# EAGLE design PT_2016_PB_4lyr_Rev2 (EAGLE 6.5.0)
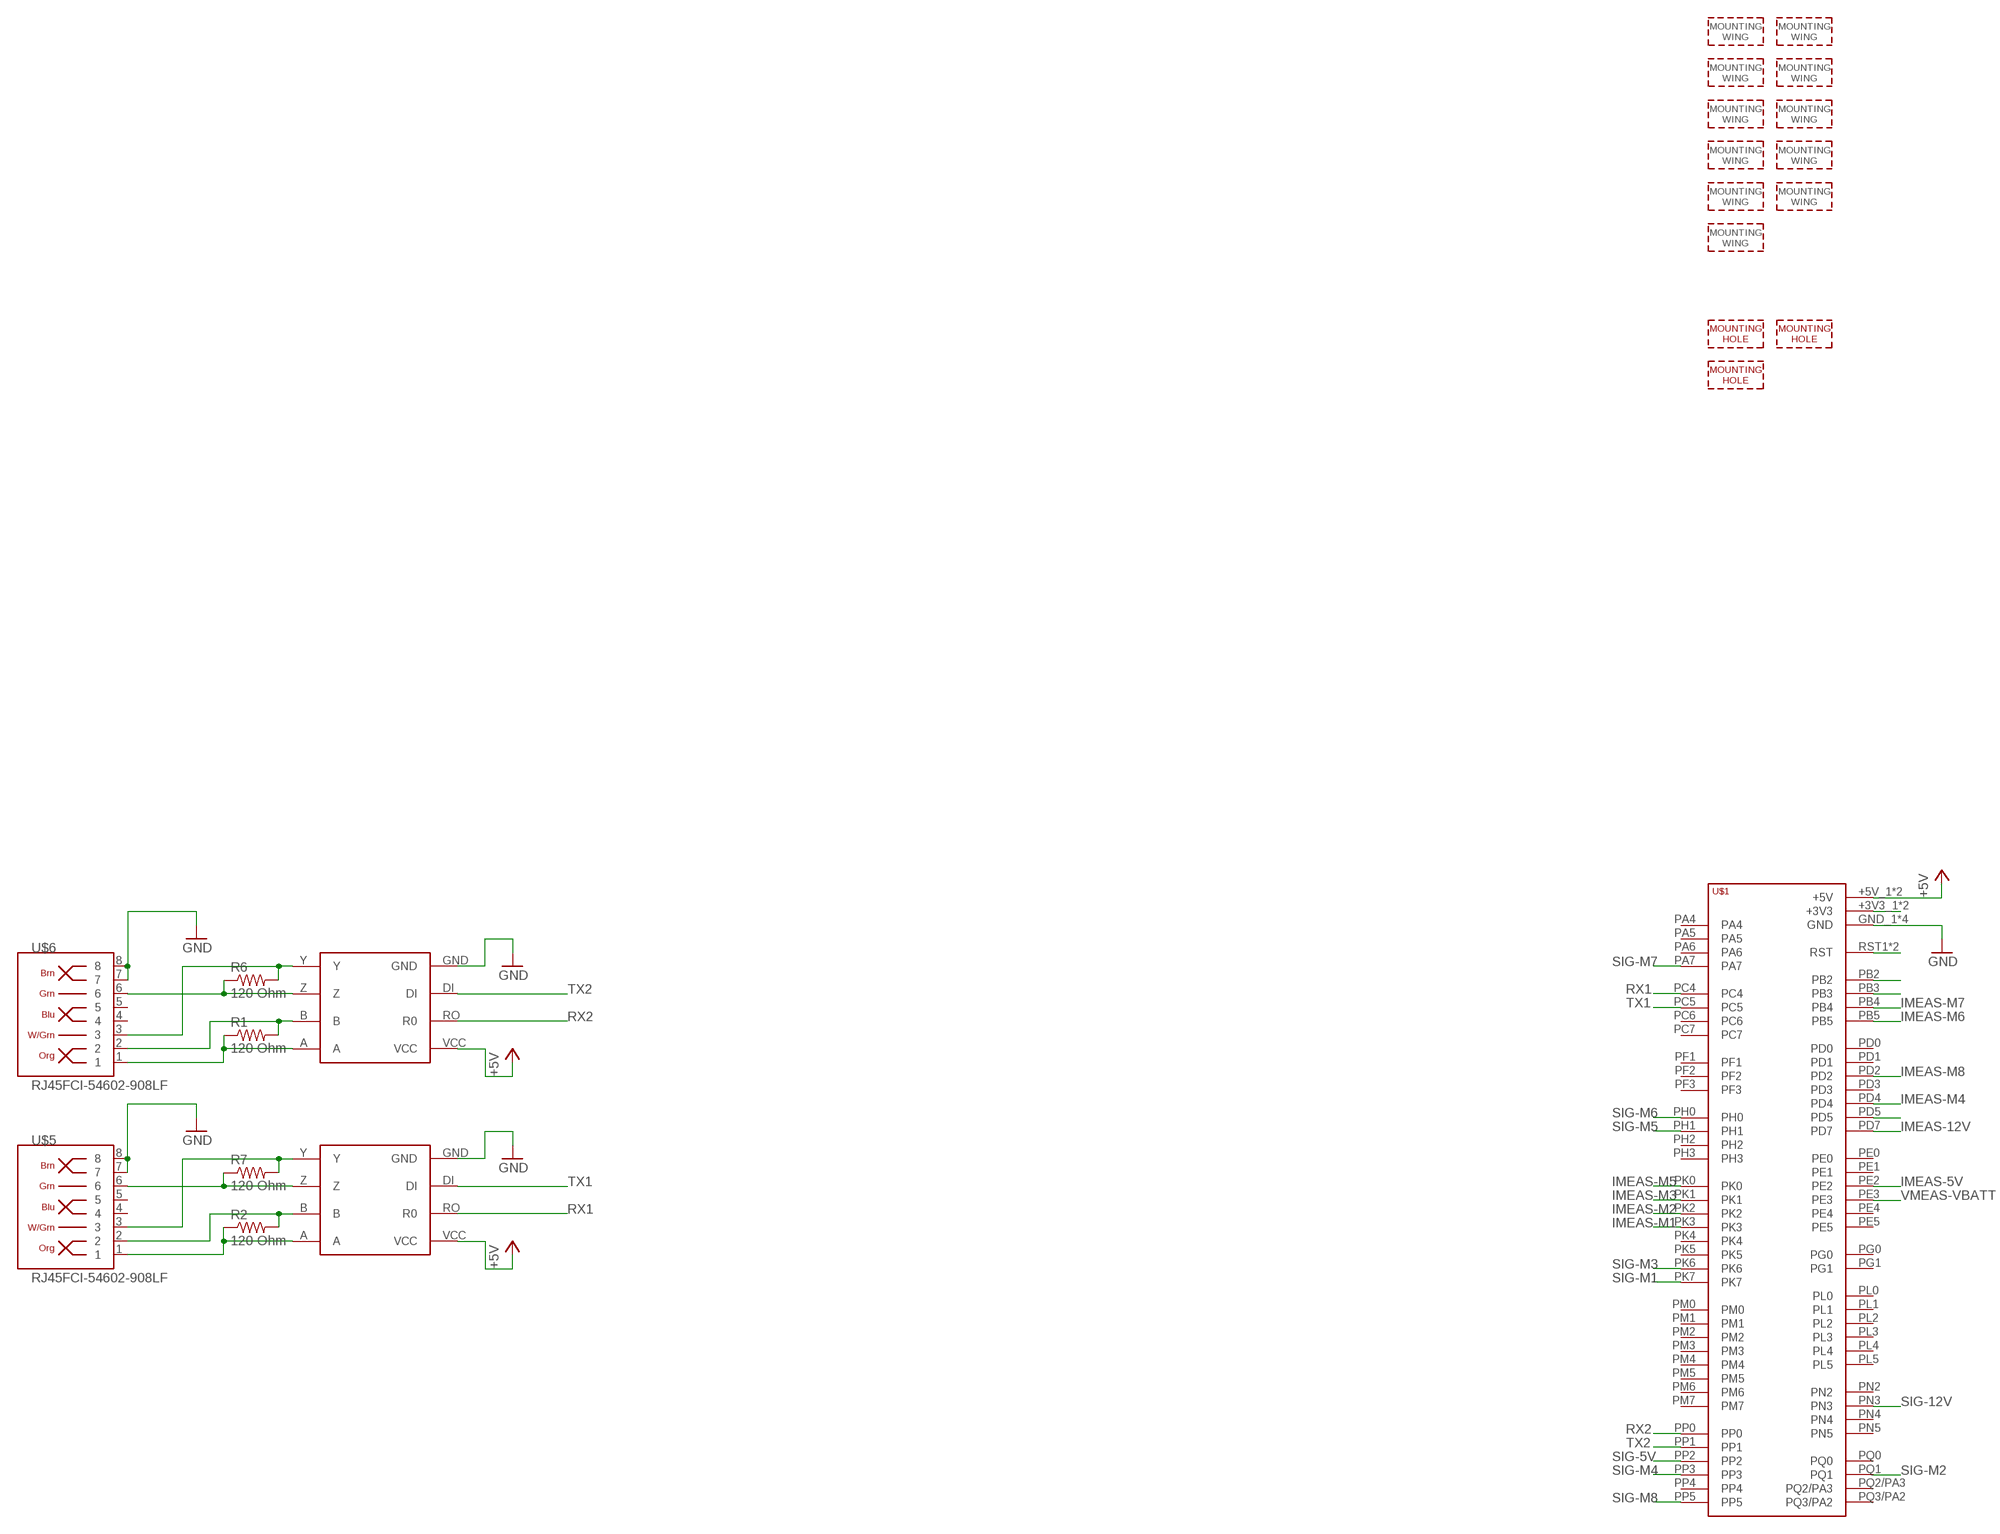
[diagram p0: schematic, sheet 1, part 1 of 3]
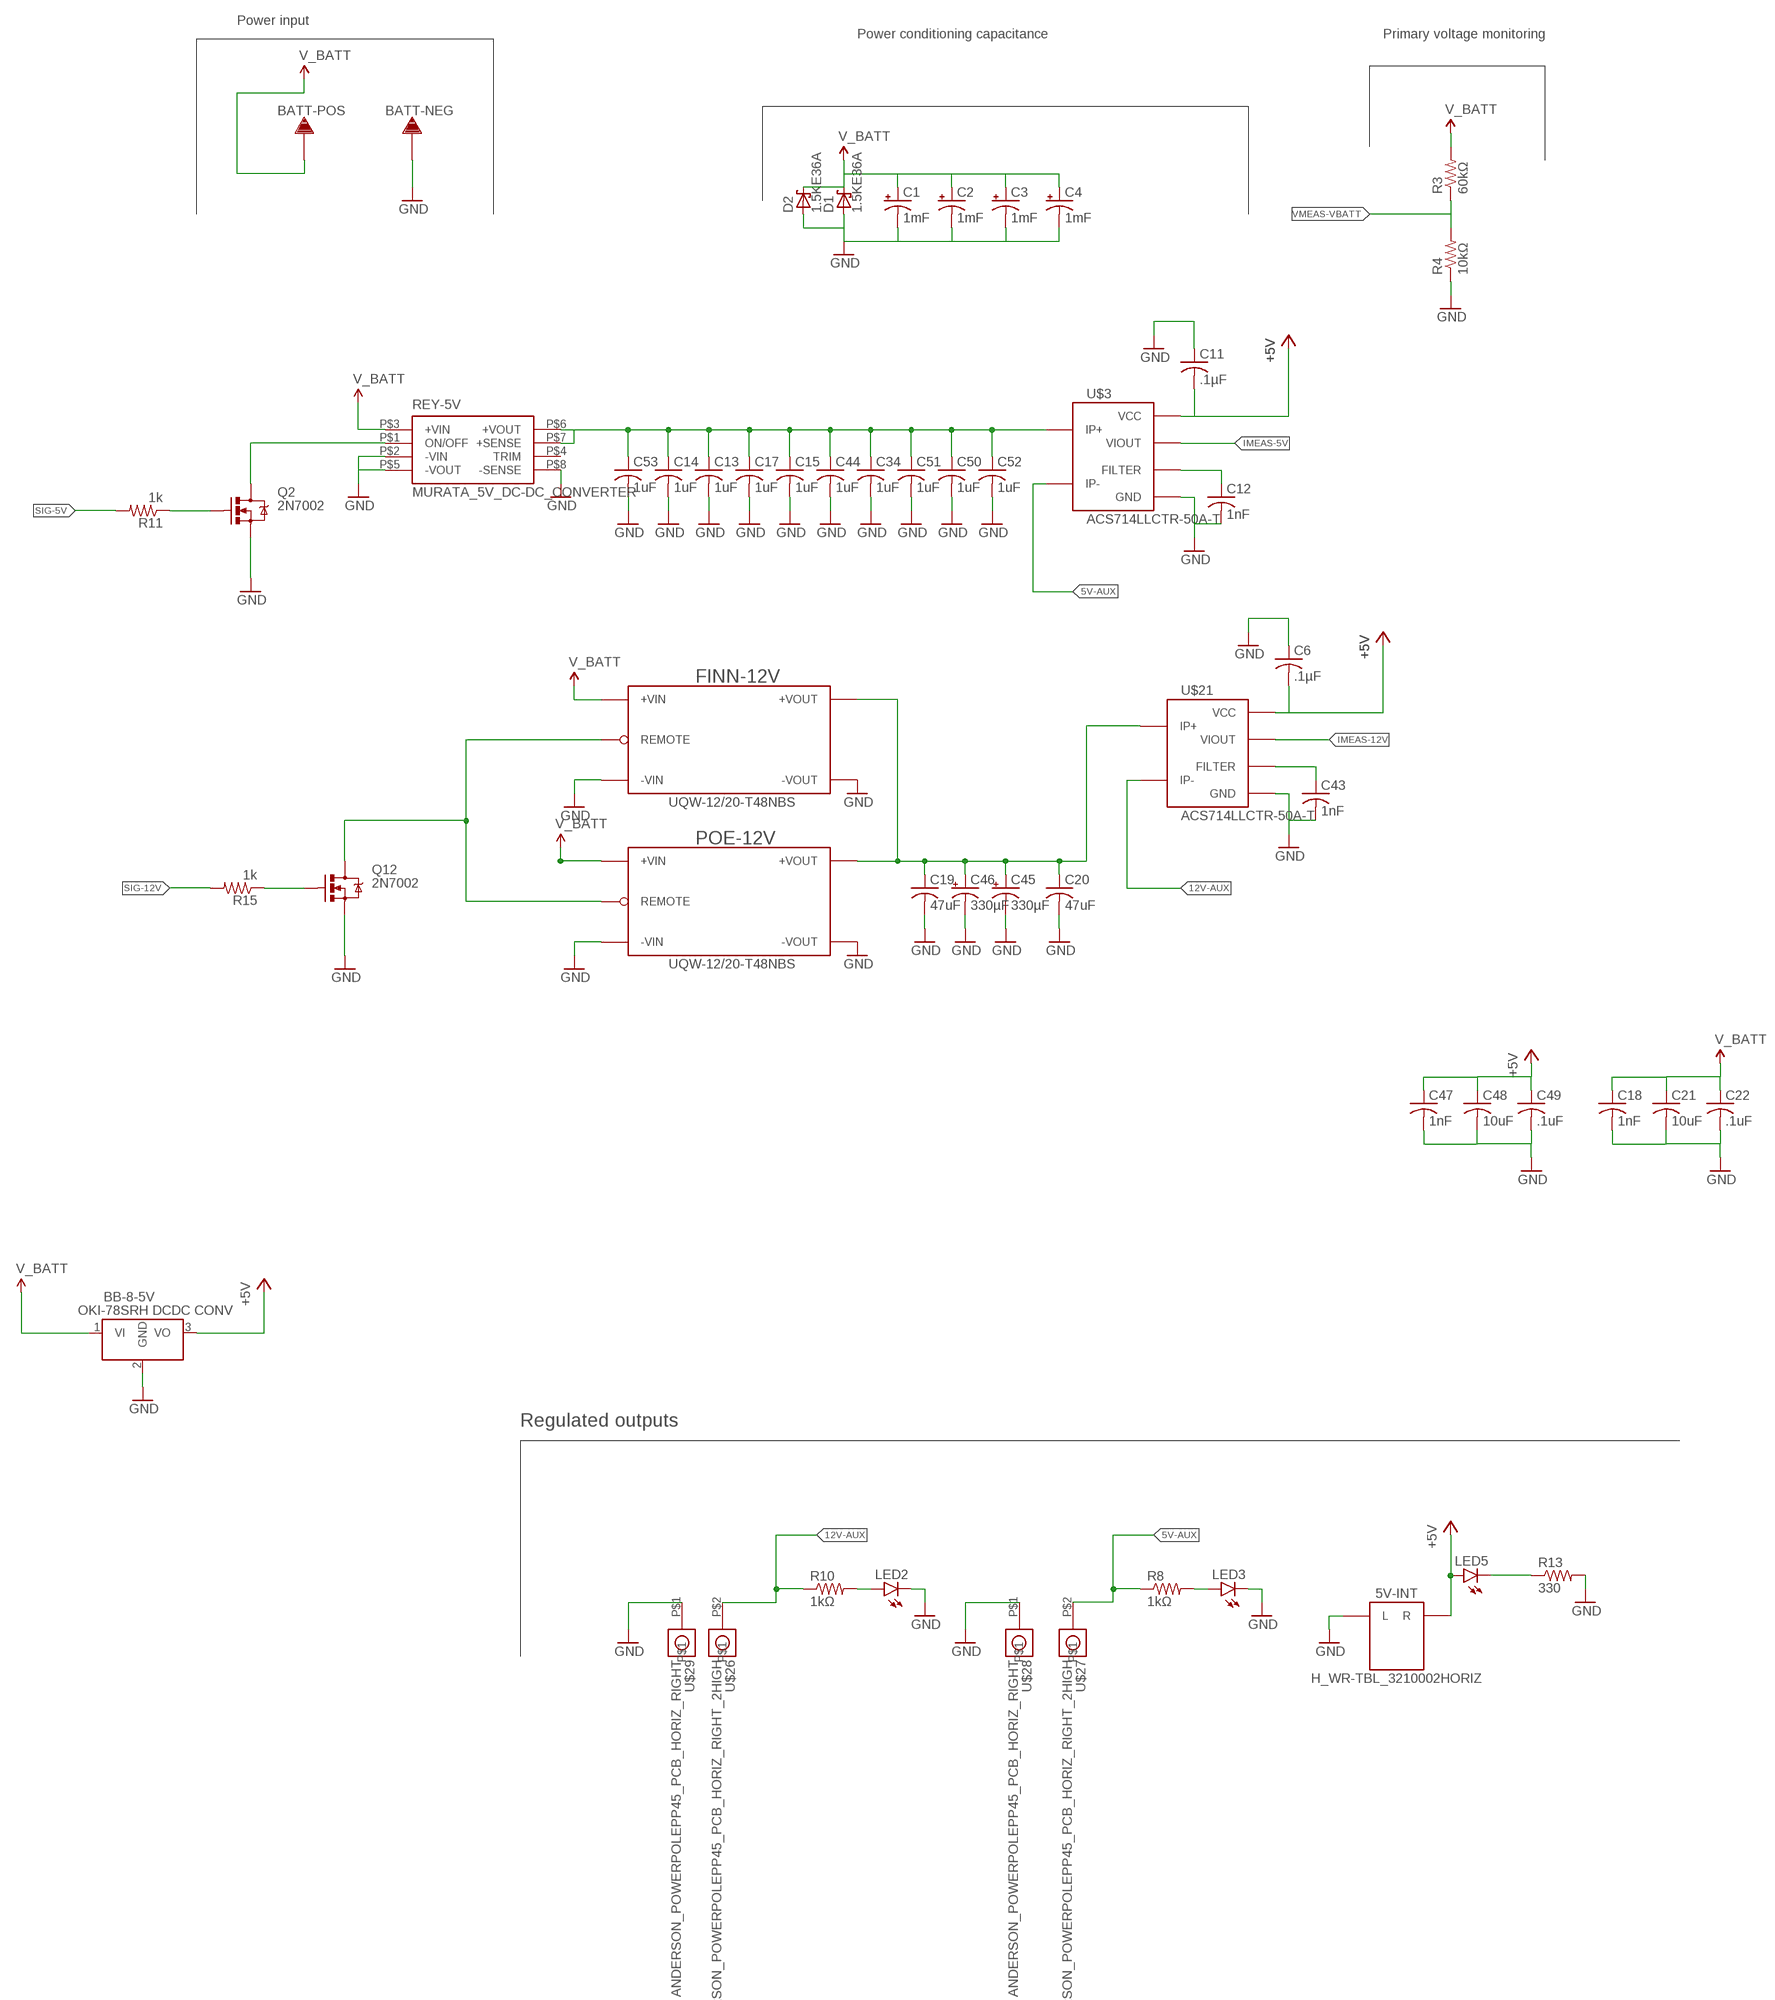
[diagram p1: schematic, sheet 1, part 2 of 3]
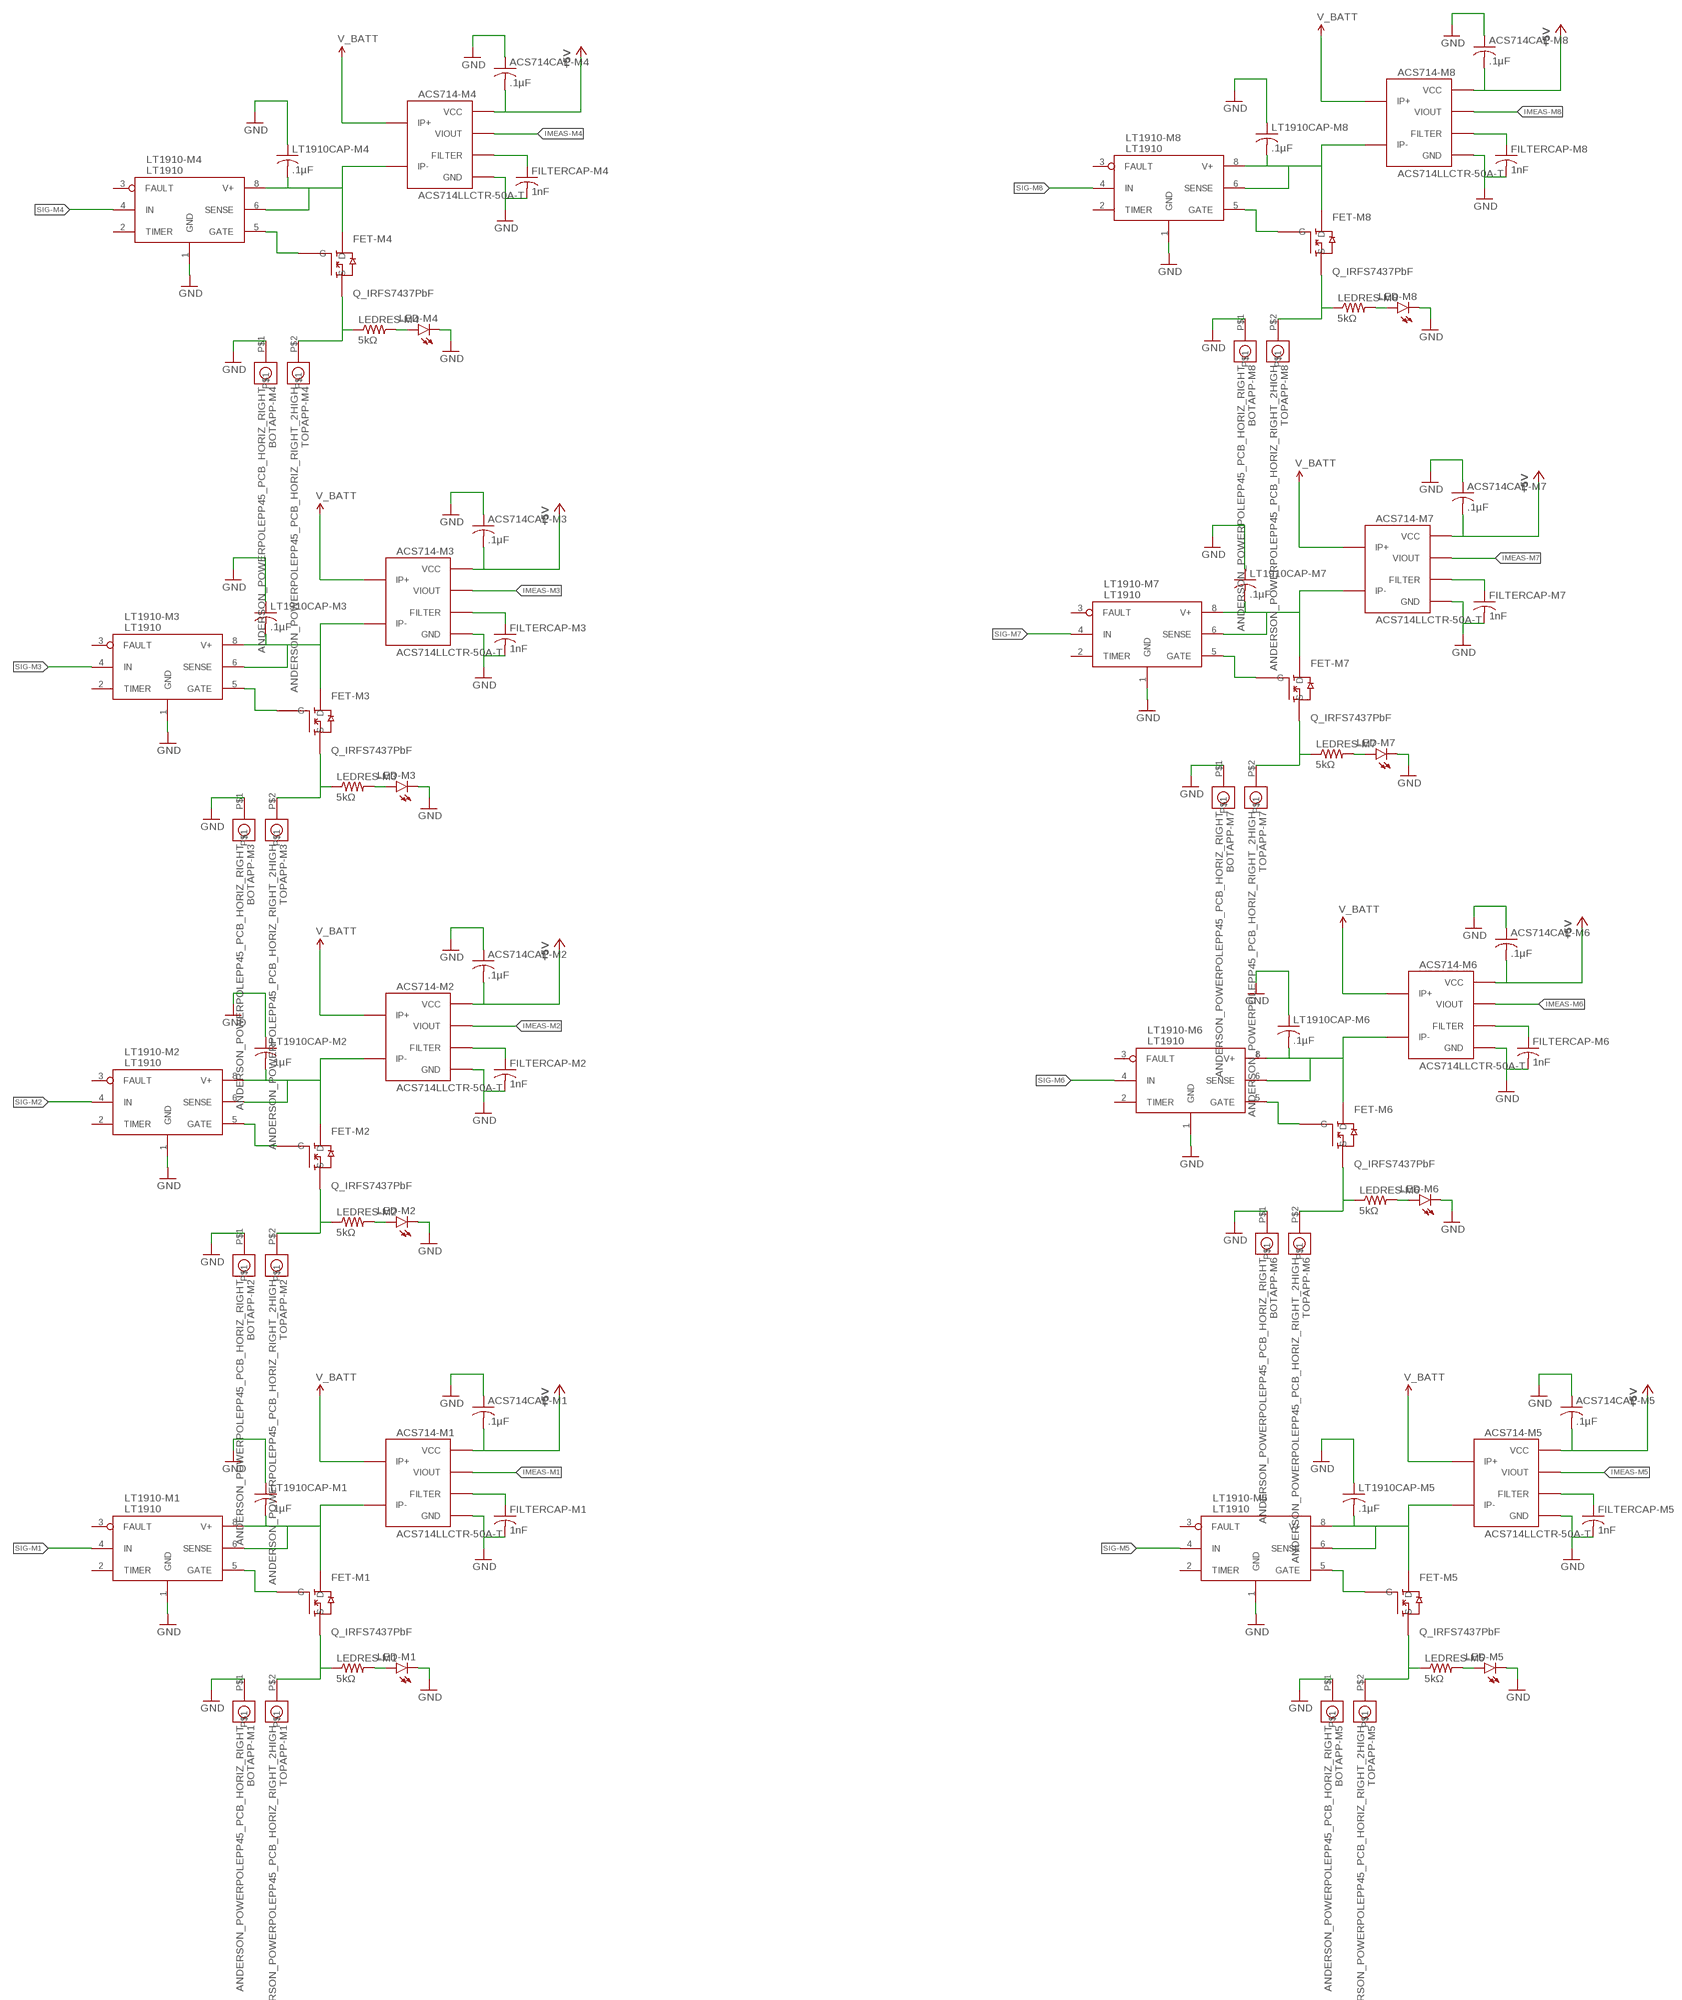
[diagram p2: schematic, sheet 1, part 3 of 3]

## Parts
5V-INT  H_WR-TBL_3210002HORIZ  [691322110002]
ACS714-M1  ACS714LLCTR-50A-T  Q_ACS714  [SOIC8_ACS711]
ACS714-M2  ACS714LLCTR-50A-T  Q_ACS714  [SOIC8_ACS711]
ACS714-M3  ACS714LLCTR-50A-T  Q_ACS714  [SOIC8_ACS711]
ACS714-M4  ACS714LLCTR-50A-T  Q_ACS714  [SOIC8_ACS711]
ACS714-M5  ACS714LLCTR-50A-T  Q_ACS714  [SOIC8_ACS711]
ACS714-M6  ACS714LLCTR-50A-T  Q_ACS714  [SOIC8_ACS711]
ACS714-M7  ACS714LLCTR-50A-T  Q_ACS714  [SOIC8_ACS711]
ACS714-M8  ACS714LLCTR-50A-T  Q_ACS714  [SOIC8_ACS711]
ACS714CAP-M1  .1µF  C-USC1206  [C1206]
ACS714CAP-M2  .1µF  C-USC1206  [C1206]
ACS714CAP-M3  .1µF  C-USC1206  [C1206]
ACS714CAP-M4  .1µF  C-USC1206  [C1206]
ACS714CAP-M5  .1µF  C-USC1206  [C1206]
ACS714CAP-M6  .1µF  C-USC1206  [C1206]
ACS714CAP-M7  .1µF  C-USC1206  [C1206]
ACS714CAP-M8  .1µF  C-USC1206  [C1206]
BATT-NEG  TERMINAL_HOLE  [LARGE_TERMINAL_HOLE]
BATT-POS  TERMINAL_HOLE  [LARGE_TERMINAL_HOLE]
BB-8-5V  Q_OKI-78SR  [OKI-78SRH]
BOTAPP-M1  ANDERSON_POWERPOLEPP45_PCB_HORIZ_RIGHT  [APP45_PCB_HORIZ_RIGHT]
BOTAPP-M2  ANDERSON_POWERPOLEPP45_PCB_HORIZ_RIGHT  [APP45_PCB_HORIZ_RIGHT]
BOTAPP-M3  ANDERSON_POWERPOLEPP45_PCB_HORIZ_RIGHT  [APP45_PCB_HORIZ_RIGHT]
BOTAPP-M4  ANDERSON_POWERPOLEPP45_PCB_HORIZ_RIGHT  [APP45_PCB_HORIZ_RIGHT]
BOTAPP-M5  ANDERSON_POWERPOLEPP45_PCB_HORIZ_RIGHT  [APP45_PCB_HORIZ_RIGHT]
BOTAPP-M6  ANDERSON_POWERPOLEPP45_PCB_HORIZ_RIGHT  [APP45_PCB_HORIZ_RIGHT]
BOTAPP-M7  ANDERSON_POWERPOLEPP45_PCB_HORIZ_RIGHT  [APP45_PCB_HORIZ_RIGHT]
BOTAPP-M8  ANDERSON_POWERPOLEPP45_PCB_HORIZ_RIGHT  [APP45_PCB_HORIZ_RIGHT]
C1  1mF  C_POL12.5MM_NORMAL  [C_12.5MM]
C2  1mF  C_POL12.5MM_NORMAL  [C_12.5MM]
C3  1mF  C_POL12.5MM_NORMAL  [C_12.5MM]
C4  1mF  C_POL12.5MM_NORMAL  [C_12.5MM]
C6  .1µF  C-USC1206  [C1206]
C11  .1µF  C-USC1206  [C1206]
C12  1nF  C-USC1206  [C1206]
C13  1uF  C-USC1206  [C1206]
C14  1uF  C-USC1206  [C1206]
C15  1uF  C-USC1206  [C1206]
C17  1uF  C-USC1206  [C1206]
C18  1nF  C-USC1206  [C1206]
C19  47uF  C-USC1206  [C1206]
C20  47uF  C-USC1206  [C1206]
C21  10uF  C-USC1206  [C1206]
C22  .1uF  C-USC1206  [C1206]
C34  1uF  C-USC1206  [C1206]
C43  1nF  C-USC1206  [C1206]
C44  1uF  C-USC1206  [C1206]
C45  330µF  CPOL-USE5-8.5  [E5-8,5]
C46  330µF  CPOL-USE5-8.5  [E5-8,5]
C47  1nF  C-USC1206  [C1206]
C48  10uF  C-USC1206  [C1206]
C49  .1uF  C-USC1206  [C1206]
C50  1uF  C-USC1206  [C1206]
C51  1uF  C-USC1206  [C1206]
C52  1uF  C-USC1206  [C1206]
C53  1uF  C-USC1206  [C1206]
D1  1.5KE36A  15KEXX  [CB429-17]
D2  1.5KE36A  15KEXX  [CB429-17]
FET-M1  Q_IRFS7437PbF  Q_IRF7437SMD  [D2PACK]
FET-M2  Q_IRFS7437PbF  Q_IRF7437SMD  [D2PACK]
FET-M3  Q_IRFS7437PbF  Q_IRF7437SMD  [D2PACK]
FET-M4  Q_IRFS7437PbF  Q_IRF7437SMD  [D2PACK]
FET-M5  Q_IRFS7437PbF  Q_IRF7437SMD  [D2PACK]
FET-M6  Q_IRFS7437PbF  Q_IRF7437SMD  [D2PACK]
FET-M7  Q_IRFS7437PbF  Q_IRF7437SMD  [D2PACK]
FET-M8  Q_IRFS7437PbF  Q_IRF7437SMD  [D2PACK]
FILTERCAP-M1  1nF  C-USC1206  [C1206]
FILTERCAP-M2  1nF  C-USC1206  [C1206]
FILTERCAP-M3  1nF  C-USC1206  [C1206]
FILTERCAP-M4  1nF  C-USC1206  [C1206]
FILTERCAP-M5  1nF  C-USC1206  [C1206]
FILTERCAP-M6  1nF  C-USC1206  [C1206]
FILTERCAP-M7  1nF  C-USC1206  [C1206]
FILTERCAP-M8  1nF  C-USC1206  [C1206]
FINN-12V  UQW-12/20-T48NBS  [U-T48-QB-NO_TRIM]
LED2  LED1206  [LED-1206]
LED3  LED1206  [LED-1206]
LED5  LED1206  [LED-1206]
LED-M1  LED1206  [LED-1206]
LED-M2  LED1206  [LED-1206]
LED-M3  LED1206  [LED-1206]
LED-M4  LED1206  [LED-1206]
LED-M5  LED1206  [LED-1206]
LED-M6  LED1206  [LED-1206]
LED-M7  LED1206  [LED-1206]
LED-M8  LED1206  [LED-1206]
LEDRES-M1  5kΩ  RESISTOR1206  [1206]
LEDRES-M2  5kΩ  RESISTOR1206  [1206]
LEDRES-M3  5kΩ  RESISTOR1206  [1206]
LEDRES-M4  5kΩ  RESISTOR1206  [1206]
LEDRES-M5  5kΩ  RESISTOR1206  [1206]
LEDRES-M6  5kΩ  RESISTOR1206  [1206]
LEDRES-M7  5kΩ  RESISTOR1206  [1206]
LEDRES-M8  5kΩ  RESISTOR1206  [1206]
LT1910-M1  LT1910  [SO8]
LT1910-M2  LT1910  [SO8]
LT1910-M3  LT1910  [SO8]
LT1910-M4  LT1910  [SO8]
LT1910-M5  LT1910  [SO8]
LT1910-M6  LT1910  [SO8]
LT1910-M7  LT1910  [SO8]
LT1910-M8  LT1910  [SO8]
LT1910CAP-M1  .1µF  C-USC1206  [C1206]
LT1910CAP-M2  .1µF  C-USC1206  [C1206]
LT1910CAP-M3  .1µF  C-USC1206  [C1206]
LT1910CAP-M4  .1µF  C-USC1206  [C1206]
LT1910CAP-M5  .1µF  C-USC1206  [C1206]
LT1910CAP-M6  .1µF  C-USC1206  [C1206]
LT1910CAP-M7  .1µF  C-USC1206  [C1206]
LT1910CAP-M8  .1µF  C-USC1206  [C1206]
POE-12V  UQW-12/20-T48NBS  [U-T48-QB-NO_TRIM]
Q2  2N7002  MOSFET-NCHANNEL2N7002PW  [SOT323]
Q12  2N7002  MOSFET-NCHANNEL2N7002PW  [SOT323]
R1  120 Ohm  RESISTOR1206  [1206]
R2  120 Ohm  RESISTOR1206  [1206]
R3  60kΩ  R-US_R1206  [R1206]
R4  10kΩ  R-US_R1206  [R1206]
R6  120 Ohm  RESISTOR1206  [1206]
R7  120 Ohm  RESISTOR1206  [1206]
R8  1kΩ  RESISTOR1206  [1206]
R10  1kΩ  RESISTOR1206  [1206]
R11  1k  R-US_R1206  [R1206]
R13  330  RESISTOR1206  [1206]
R15  1k  R-US_R1206  [R1206]
REY-5V  MURATA_5V_DC-DC_CONVERTER  [MURATA_5V_DC-DC_CONVERTER]
TOPAPP-M1  ANDERSON_POWERPOLEPP45_PCB_HORIZ_RIGHT_2HIGH  [APP45_PCB_HORIZ_RIGHT_2HIGH]
TOPAPP-M2  ANDERSON_POWERPOLEPP45_PCB_HORIZ_RIGHT_2HIGH  [APP45_PCB_HORIZ_RIGHT_2HIGH]
TOPAPP-M3  ANDERSON_POWERPOLEPP45_PCB_HORIZ_RIGHT_2HIGH  [APP45_PCB_HORIZ_RIGHT_2HIGH]
TOPAPP-M4  ANDERSON_POWERPOLEPP45_PCB_HORIZ_RIGHT_2HIGH  [APP45_PCB_HORIZ_RIGHT_2HIGH]
TOPAPP-M5  ANDERSON_POWERPOLEPP45_PCB_HORIZ_RIGHT_2HIGH  [APP45_PCB_HORIZ_RIGHT_2HIGH]
TOPAPP-M6  ANDERSON_POWERPOLEPP45_PCB_HORIZ_RIGHT_2HIGH  [APP45_PCB_HORIZ_RIGHT_2HIGH]
TOPAPP-M7  ANDERSON_POWERPOLEPP45_PCB_HORIZ_RIGHT_2HIGH  [APP45_PCB_HORIZ_RIGHT_2HIGH]
TOPAPP-M8  ANDERSON_POWERPOLEPP45_PCB_HORIZ_RIGHT_2HIGH  [APP45_PCB_HORIZ_RIGHT_2HIGH]
U$1  TIVA-C-CONNECTED  [TIVA-C-CONNECTED]
U$2  APP_MOUTING_WINGHORIZ  [APP45_MOUNTING_WING_HORIZ]
U$3  ACS714LLCTR-50A-T  Q_ACS714  [SOIC8_ACS711]
U$4  APP_MOUTING_WINGHORIZ  [APP45_MOUNTING_WING_HORIZ]
U$5  RJ45FCI-54602-908LF  [FCI-54602-908LF]
U$6  RJ45FCI-54602-908LF  [FCI-54602-908LF]
U$8  MOUNTING_HOLE#8  [#8_SCREW]
U$10  MOUNTING_HOLE#8  [#8_SCREW]
U$11  MOUNTING_HOLE#8  [#8_SCREW]
U$12  MAX3077  [MAX3070E]
U$21  ACS714LLCTR-50A-T  Q_ACS714  [SOIC8_ACS711]
U$24  MAX3077  [MAX3070E]
U$25  APP_MOUTING_WINGHORIZ  [APP45_MOUNTING_WING_HORIZ]
U$26  ANDERSON_POWERPOLEPP45_PCB_HORIZ_RIGHT_2HIGH  [APP45_PCB_HORIZ_RIGHT_2HIGH]
U$27  ANDERSON_POWERPOLEPP45_PCB_HORIZ_RIGHT_2HIGH  [APP45_PCB_HORIZ_RIGHT_2HIGH]
U$28  ANDERSON_POWERPOLEPP45_PCB_HORIZ_RIGHT  [APP45_PCB_HORIZ_RIGHT]
U$29  ANDERSON_POWERPOLEPP45_PCB_HORIZ_RIGHT  [APP45_PCB_HORIZ_RIGHT]
U$30  APP_MOUTING_WINGHORIZ  [APP45_MOUNTING_WING_HORIZ]
U$31  APP_MOUTING_WINGHORIZ  [APP45_MOUNTING_WING_HORIZ]
U$32  APP_MOUTING_WINGHORIZ  [APP45_MOUNTING_WING_HORIZ]
U$33  APP_MOUTING_WINGHORIZ  [APP45_MOUNTING_WING_HORIZ]
U$34  APP_MOUTING_WINGHORIZ  [APP45_MOUNTING_WING_HORIZ]
U$35  APP_MOUTING_WINGHORIZ  [APP45_MOUNTING_WING_HORIZ]
U$41  APP_MOUTING_WINGHORIZ  [APP45_MOUNTING_WING_HORIZ]
U$42  APP_MOUTING_WINGHORIZ  [APP45_MOUNTING_WING_HORIZ]

## Nets
5V-AUX: R8.1 U$3.4(IP-) U$27.P$2
12V-AUX: R10.1 U$21.4(IP-) U$26.P$2
+5V: 5V-INT.R ACS714-M1.8(VCC) ACS714-M2.8(VCC) ACS714-M3.8(VCC) ACS714-M4.8(VCC) ACS714-M5.8(VCC) ACS714-M6.8(VCC) ACS714-M7.8(VCC) ACS714-M8.8(VCC) ACS714CAP-M1.2 ACS714CAP-M2.2 ACS714CAP-M3.2 ACS714CAP-M4.2 ACS714CAP-M5.2 ACS714CAP-M6.2 ACS714CAP-M7.2 ACS714CAP-M8.2 BB-8-5V.3(VO) C6.2 C11.2 C47.1 C48.1 C49.1 LED5.A U$1.+5V_1(+5V) U$1.+5V_2(+5V) U$3.8(VCC) U$12.VCC U$21.8(VCC) U$24.VCC
DRAIN-M1: ACS714-M1.4(IP-) FET-M1.TAB(D) LT1910-M1.6(SENSE) LT1910-M1.8(V+) LT1910CAP-M1.2
DRAIN-M2: ACS714-M2.4(IP-) FET-M2.TAB(D) LT1910-M2.6(SENSE) LT1910-M2.8(V+) LT1910CAP-M2.2
DRAIN-M3: ACS714-M3.4(IP-) FET-M3.TAB(D) LT1910-M3.6(SENSE) LT1910-M3.8(V+) LT1910CAP-M3.2
DRAIN-M4: ACS714-M4.4(IP-) FET-M4.TAB(D) LT1910-M4.6(SENSE) LT1910-M4.8(V+) LT1910CAP-M4.2
DRAIN-M5: ACS714-M5.4(IP-) FET-M5.TAB(D) LT1910-M5.6(SENSE) LT1910-M5.8(V+) LT1910CAP-M5.2
DRAIN-M6: ACS714-M6.4(IP-) FET-M6.TAB(D) LT1910-M6.6(SENSE) LT1910-M6.8(V+) LT1910CAP-M6.2
DRAIN-M7: ACS714-M7.4(IP-) FET-M7.TAB(D) LT1910-M7.6(SENSE) LT1910-M7.8(V+) LT1910CAP-M7.2
DRAIN-M8: ACS714-M8.4(IP-) FET-M8.TAB(D) LT1910-M8.6(SENSE) LT1910-M8.8(V+) LT1910CAP-M8.2
FILTER-M1: ACS714-M1.6(FILTER) FILTERCAP-M1.1
FILTER-M2: ACS714-M2.6(FILTER) FILTERCAP-M2.1
FILTER-M3: ACS714-M3.6(FILTER) FILTERCAP-M3.1
FILTER-M4: ACS714-M4.6(FILTER) FILTERCAP-M4.1
FILTER-M5: ACS714-M5.6(FILTER) FILTERCAP-M5.1
FILTER-M6: ACS714-M6.6(FILTER) FILTERCAP-M6.1
FILTER-M7: ACS714-M7.6(FILTER) FILTERCAP-M7.1
FILTER-M8: ACS714-M8.6(FILTER) FILTERCAP-M8.1
GATE-M1: FET-M1.1(G) LT1910-M1.5(GATE)
GATE-M2: FET-M2.1(G) LT1910-M2.5(GATE)
GATE-M3: FET-M3.1(G) LT1910-M3.5(GATE)
GATE-M4: FET-M4.1(G) LT1910-M4.5(GATE)
GATE-M5: FET-M5.1(G) LT1910-M5.5(GATE)
GATE-M6: FET-M6.1(G) LT1910-M6.5(GATE)
GATE-M7: FET-M7.1(G) LT1910-M7.5(GATE)
GATE-M8: FET-M8.1(G) LT1910-M8.5(GATE)
GND: 5V-INT.L ACS714-M1.5(GND) ACS714-M2.5(GND) ACS714-M3.5(GND) ACS714-M4.5(GND) ACS714-M5.5(GND) ACS714-M6.5(GND) ACS714-M7.5(GND) ACS714-M8.5(GND) ACS714CAP-M1.1 ACS714CAP-M2.1 ACS714CAP-M3.1 ACS714CAP-M4.1 ACS714CAP-M5.1 ACS714CAP-M6.1 ACS714CAP-M7.1 ACS714CAP-M8.1 BATT-NEG.P$1 BB-8-5V.2(GND) BOTAPP-M1.P$1 BOTAPP-M2.P$1 BOTAPP-M3.P$1 BOTAPP-M4.P$1 BOTAPP-M5.P$1 BOTAPP-M6.P$1 BOTAPP-M7.P$1 BOTAPP-M8.P$1 C1.- C2.- C3.- C4.- C6.1 C11.1 C12.2 C13.2 C14.2 C15.2 C17.2 C18.2 C19.2 C20.2 C21.2 C22.2 C34.2 C43.2 C44.2 C45.- C46.- C47.2 C48.2 C49.2 C50.2 C51.2 C52.2 C53.2 D1.A D2.A FILTERCAP-M1.2 FILTERCAP-M2.2 FILTERCAP-M3.2 FILTERCAP-M4.2 FILTERCAP-M5.2 FILTERCAP-M6.2 FILTERCAP-M7.2 FILTERCAP-M8.2 FINN-12V.3(-VIN) FINN-12V.4(-VOUT) LED2.C LED3.C LED-M1.C LED-M2.C LED-M3.C LED-M4.C LED-M5.C LED-M6.C LED-M7.C LED-M8.C LT1910-M1.1(GND) LT1910-M2.1(GND) LT1910-M3.1(GND) LT1910-M4.1(GND) LT1910-M5.1(GND) LT1910-M6.1(GND) LT1910-M7.1(GND) LT1910-M8.1(GND) LT1910CAP-M1.1 LT1910CAP-M2.1 LT1910CAP-M3.1 LT1910CAP-M4.1 LT1910CAP-M5.1 LT1910CAP-M6.1 LT1910CAP-M7.1 LT1910CAP-M8.1 POE-12V.3(-VIN) POE-12V.4(-VOUT) Q2.2(S) Q12.2(S) R4.1 R13.2 REY-5V.P$2(-VIN) REY-5V.P$5(-VOUT) REY-5V.P$8(-SENSE) U$1.GND_1(GND) U$1.GND_2(GND) U$1.GND_3(GND) U$1.GND_4(GND) U$3.5(GND) U$5.7 U$5.8 U$6.7 U$6.8 U$12.GND U$21.5(GND) U$24.GND U$28.P$1 U$29.P$1
IMEAS-5V: U$1.PE2 U$3.7(VIOUT)
IMEAS-12V: U$1.PD7 U$21.7(VIOUT)
IMEAS-M1: ACS714-M1.7(VIOUT) U$1.PK3
IMEAS-M2: ACS714-M2.7(VIOUT) U$1.PK2
IMEAS-M3: ACS714-M3.7(VIOUT) U$1.PK1
IMEAS-M4: ACS714-M4.7(VIOUT) U$1.PD4
IMEAS-M5: ACS714-M5.7(VIOUT) U$1.PK0
IMEAS-M6: ACS714-M6.7(VIOUT) U$1.PB5
IMEAS-M7: ACS714-M7.7(VIOUT) U$1.PB4
IMEAS-M8: ACS714-M8.7(VIOUT) U$1.PD2
LEDLINE-M1: LED-M1.A LEDRES-M1.2
LEDLINE-M2: LED-M2.A LEDRES-M2.2
LEDLINE-M3: LED-M3.A LEDRES-M3.2
LEDLINE-M4: LED-M4.A LEDRES-M4.2
LEDLINE-M5: LED-M5.A LEDRES-M5.2
LEDLINE-M6: LED-M6.A LEDRES-M6.2
LEDLINE-M7: LED-M7.A LEDRES-M7.2
LEDLINE-M8: LED-M8.A LEDRES-M8.2
N$4: FINN-12V.2(REMOTE) POE-12V.2(REMOTE) Q12.3(D)
N$6: LED5.C R13.1
N$12: C43.1 U$21.6(FILTER)
N$33: C19.1 C20.1 C45.+ C46.+ FINN-12V.8(+VOUT) POE-12V.8(+VOUT) U$21.1(IP+)
N$34: LED3.A R8.2
N$38: C12.1 U$3.6(FILTER)
N$43: Q2.3(D) REY-5V.P$1(ON/OFF)
N$46: LED2.A R10.2
N$48: Q2.1(G) R11.1
N$71: C13.1 C14.1 C15.1 C17.1 C34.1 C44.1 C50.1 C51.1 C52.1 C53.1 REY-5V.P$6(+VOUT) REY-5V.P$7(+SENSE) U$3.1(IP+)
N$98: U$1.+3V3_1(+3V3) U$1.+3V3_2(+3V3)
N$100: U$1.RST1(RST) U$1.RST_2(RST)
N$101: U$1.PB2
N$102: U$1.PB3
N$110: U$1.PD5
N$114: Q12.1(G) R15.1
REC+: R1.1 U$6.1 U$12.A
REC+1: R2.1 U$5.1 U$24.A
REC-: R1.2 U$6.2 U$12.B
REC-1: R2.2 U$5.2 U$24.B
RX1: U$1.PC4 U$24.RO(R0)
RX2: U$1.PP0 U$12.RO(R0)
SIG-5V: R11.2 U$1.PP2
SIG-12V: R15.2 U$1.PN3
SIG-M1: LT1910-M1.4(IN) U$1.PK7
SIG-M2: LT1910-M2.4(IN) U$1.PQ1
SIG-M3: LT1910-M3.4(IN) U$1.PK6
SIG-M4: LT1910-M4.4(IN) U$1.PP3
SIG-M5: LT1910-M5.4(IN) U$1.PH1
SIG-M6: LT1910-M6.4(IN) U$1.PH0
SIG-M7: LT1910-M7.4(IN) U$1.PA7
SIG-M8: LT1910-M8.4(IN) U$1.PP5
SOURCE-M1: FET-M1.2(S) LEDRES-M1.1 TOPAPP-M1.P$2
SOURCE-M2: FET-M2.2(S) LEDRES-M2.1 TOPAPP-M2.P$2
SOURCE-M3: FET-M3.2(S) LEDRES-M3.1 TOPAPP-M3.P$2
SOURCE-M4: FET-M4.2(S) LEDRES-M4.1 TOPAPP-M4.P$2
SOURCE-M5: FET-M5.2(S) LEDRES-M5.1 TOPAPP-M5.P$2
SOURCE-M6: FET-M6.2(S) LEDRES-M6.1 TOPAPP-M6.P$2
SOURCE-M7: FET-M7.2(S) LEDRES-M7.1 TOPAPP-M7.P$2
SOURCE-M8: FET-M8.2(S) LEDRES-M8.1 TOPAPP-M8.P$2
TRANS+: R6.2 U$6.3 U$12.Y
TRANS+1: R7.2 U$5.3 U$24.Y
TRANS-: R6.1 U$6.6 U$12.Z
TRANS-1: R7.1 U$5.6 U$24.Z
TX1: U$1.PC5 U$24.DI
TX2: U$1.PP1 U$12.DI
V_BATT: ACS714-M1.1(IP+) ACS714-M2.1(IP+) ACS714-M3.1(IP+) ACS714-M4.1(IP+) ACS714-M5.1(IP+) ACS714-M6.1(IP+) ACS714-M7.1(IP+) ACS714-M8.1(IP+) BATT-POS.P$1 BB-8-5V.1(VI) C1.+ C2.+ C3.+ C4.+ C18.1 C21.1 C22.1 D1.C D2.C FINN-12V.1(+VIN) POE-12V.1(+VIN) R3.2 REY-5V.P$3(+VIN)
VMEAS-VBATT: R3.1 R4.2 U$1.PE3
Unconnected: LT1910-M1.2(TIMER) LT1910-M1.3(FAULT) LT1910-M2.2(TIMER) LT1910-M2.3(FAULT) LT1910-M3.2(TIMER) LT1910-M3.3(FAULT) LT1910-M4.2(TIMER) LT1910-M4.3(FAULT) LT1910-M5.2(TIMER) LT1910-M5.3(FAULT) LT1910-M6.2(TIMER) LT1910-M6.3(FAULT) LT1910-M7.2(TIMER) LT1910-M7.3(FAULT) LT1910-M8.2(TIMER) LT1910-M8.3(FAULT) REY-5V.P$4(TRIM) U$1.PA4 U$1.PA5 U$1.PA6 U$1.PC6 U$1.PC7 U$1.PD0 U$1.PD1 U$1.PD3 U$1.PE0 U$1.PE1 U$1.PE4 U$1.PE5 U$1.PF1 U$1.PF2 U$1.PF3 U$1.PG0 U$1.PG1 U$1.PH2 U$1.PH3 U$1.PK4 U$1.PK5 U$1.PL0 U$1.PL1 U$1.PL2 U$1.PL3 U$1.PL4 U$1.PL5 U$1.PM0 U$1.PM1 U$1.PM2 U$1.PM3 U$1.PM4 U$1.PM5 U$1.PM6 U$1.PM7 U$1.PN2 U$1.PN4 U$1.PN5 U$1.PP4 U$1.PQ0 U$1.PQ2/PA3 U$1.PQ3/PA2 U$5.4 U$5.5 U$6.4 U$6.5

## Notes on the sheet
- Power input
- Power conditioning capacitance | Primary voltage monitoring
- Regulated outputs

## Library data of the parts
5V-INT = MRDT-2015-PowerBoard:H_WR-TBL_32*1*0002: Wurth Electronic's 2-pin 10A pluggable screw terminal headers. Vertical and Horizantal Part Numbers: 691322110002 (Horizantal) 691321100002 (Vertical); DIGIKEY_PN: 732-2769-ND
ACS714-M1-ACS714-M8 U$3 U$21 = MRDT-2015-PowerBoard:Q_ACS714: Sketch variant has increased clearance for traces.
ACS714CAP-M1-ACS714CAP-M8 C6 C11-C15 C17-C22 C34 C43 C44 C47-C53 FILTERCAP-M1-FILTERCAP-M8 LT1910CAP-M1-LT1910CAP-M8 = resistor:C-US: CAPACITOR, American symbol
BATT-NEG BATT-POS = MRDT-2015-PowerBoard:TERMINAL_HOLE
BB-8-5V = MRDT-2015-PowerBoard:Q_OKI-78SR: 4.95W DC/DC Converter Manufacturer: Murata Part Number: OKI-78SR-5/1.5-W36H-C OKI-78SR-3.3/1.5-W36H-C
BOTAPP-M1-BOTAPP-M8 TOPAPP-M1-TOPAPP-M8 U$26-U$29 = MRDT-Connectors:ANDERSON_POWERPOLE: http://www.powerwerx.com/anderson-powerpoles/
C1-C4 = MRDT-2014-All:C_POL: Alum Elect. Cap with 10mm diameter, 5mm lead spacing and 0.7mm lead diameter
C45 C46 = resistor:CPOL-US: POLARIZED CAPACITOR, American symbol
D1 D2 = diode:15KEXX: DIODE
FET-M1-FET-M8 = MRDT-2015-PowerBoard:Q_IRF*7437: 40V 195A N-CH MOSFET switch with heatsink
FINN-12V POE-12V = MRDT-2015-PowerBoard:UQW-12/20-T48NBS
LED2 LED3 LED5 LED-M1-LED-M8 = SparkFun-LED:LED: LEDs Standard schematic elements and footprints for 5mm, 3mm, 1206, and 0603 sized LEDs. 5mm - Spark Fun Electronics SKU : COM-00529 (and others)
LEDRES-M1-LEDRES-M8 R1 R2 R6-R8 R10 R13 = SparkFun-Passives:RESISTOR: Resistor Basic schematic elements and footprints for 0603, 1206, and PTH resistors.
LT1910-M1-LT1910-M8 = Jake:LT1910
Q2 Q12 = SparkFun-DiscreteSemi:MOSFET-NCHANNEL: Common NMOSFET Parts MFG P/N Store ID Prod ID FDD8780 TRANS-09984 SI7820DN TRANS-11055 FDS6630A IC-08089 2N7002PW TRANS-11151 FQP30N06L COM-10213 TRANS-10060 BSS123LT1G TRANS-08345 BSS138 TRANS-00830 BS170 2N7000; PROD_ID: TRANS-11151
R3 R4 R11 R15 = resistor:R-US_: RESISTOR, American symbol
REY-5V = MRDT-2015-PowerBoard:MURATA_5V_DC-DC_CONVERTER
U$1 = MRDT-2015-General:TIVA-C-CONNECTED: TIVA C CONNECTED LAUNCHPAD
U$2 U$4 U$25 U$30-U$35 U$41 U$42 = MRDT-Connectors:APP_MOUTING_WING
U$5 U$6 = MRDT-2015-General:RJ45
U$8 U$10 U$11 = MRDT-Hardware:MOUNTING_HOLE
U$12 U$24 = MAX3077:MAX3077

## Board
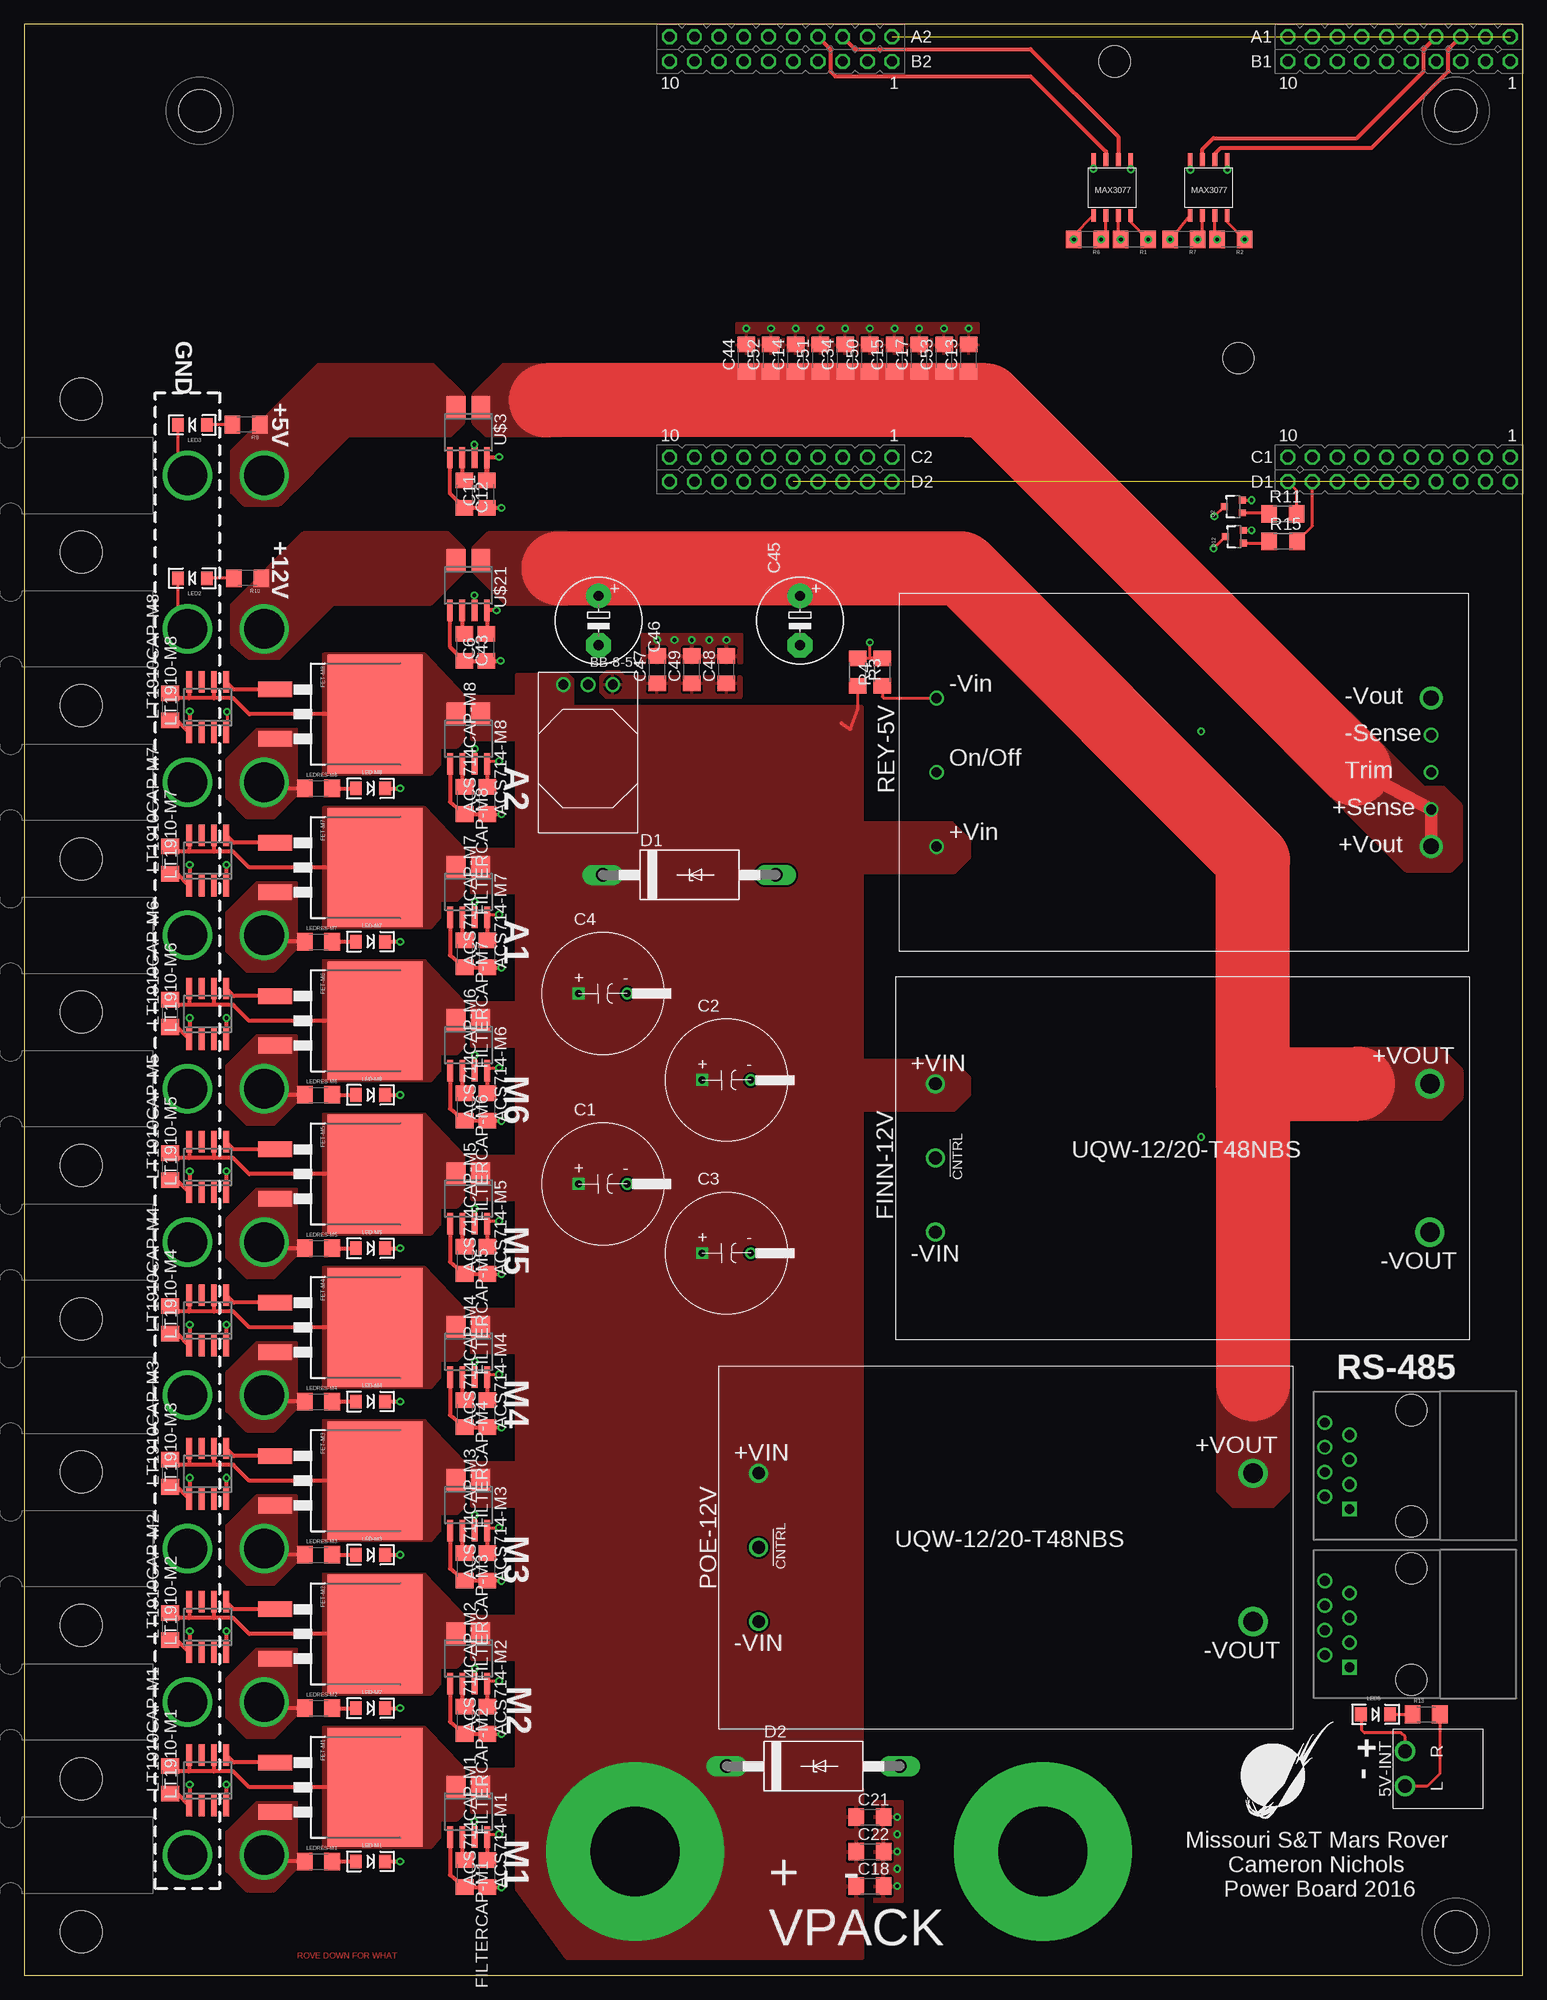
[diagram p3: board, top side]
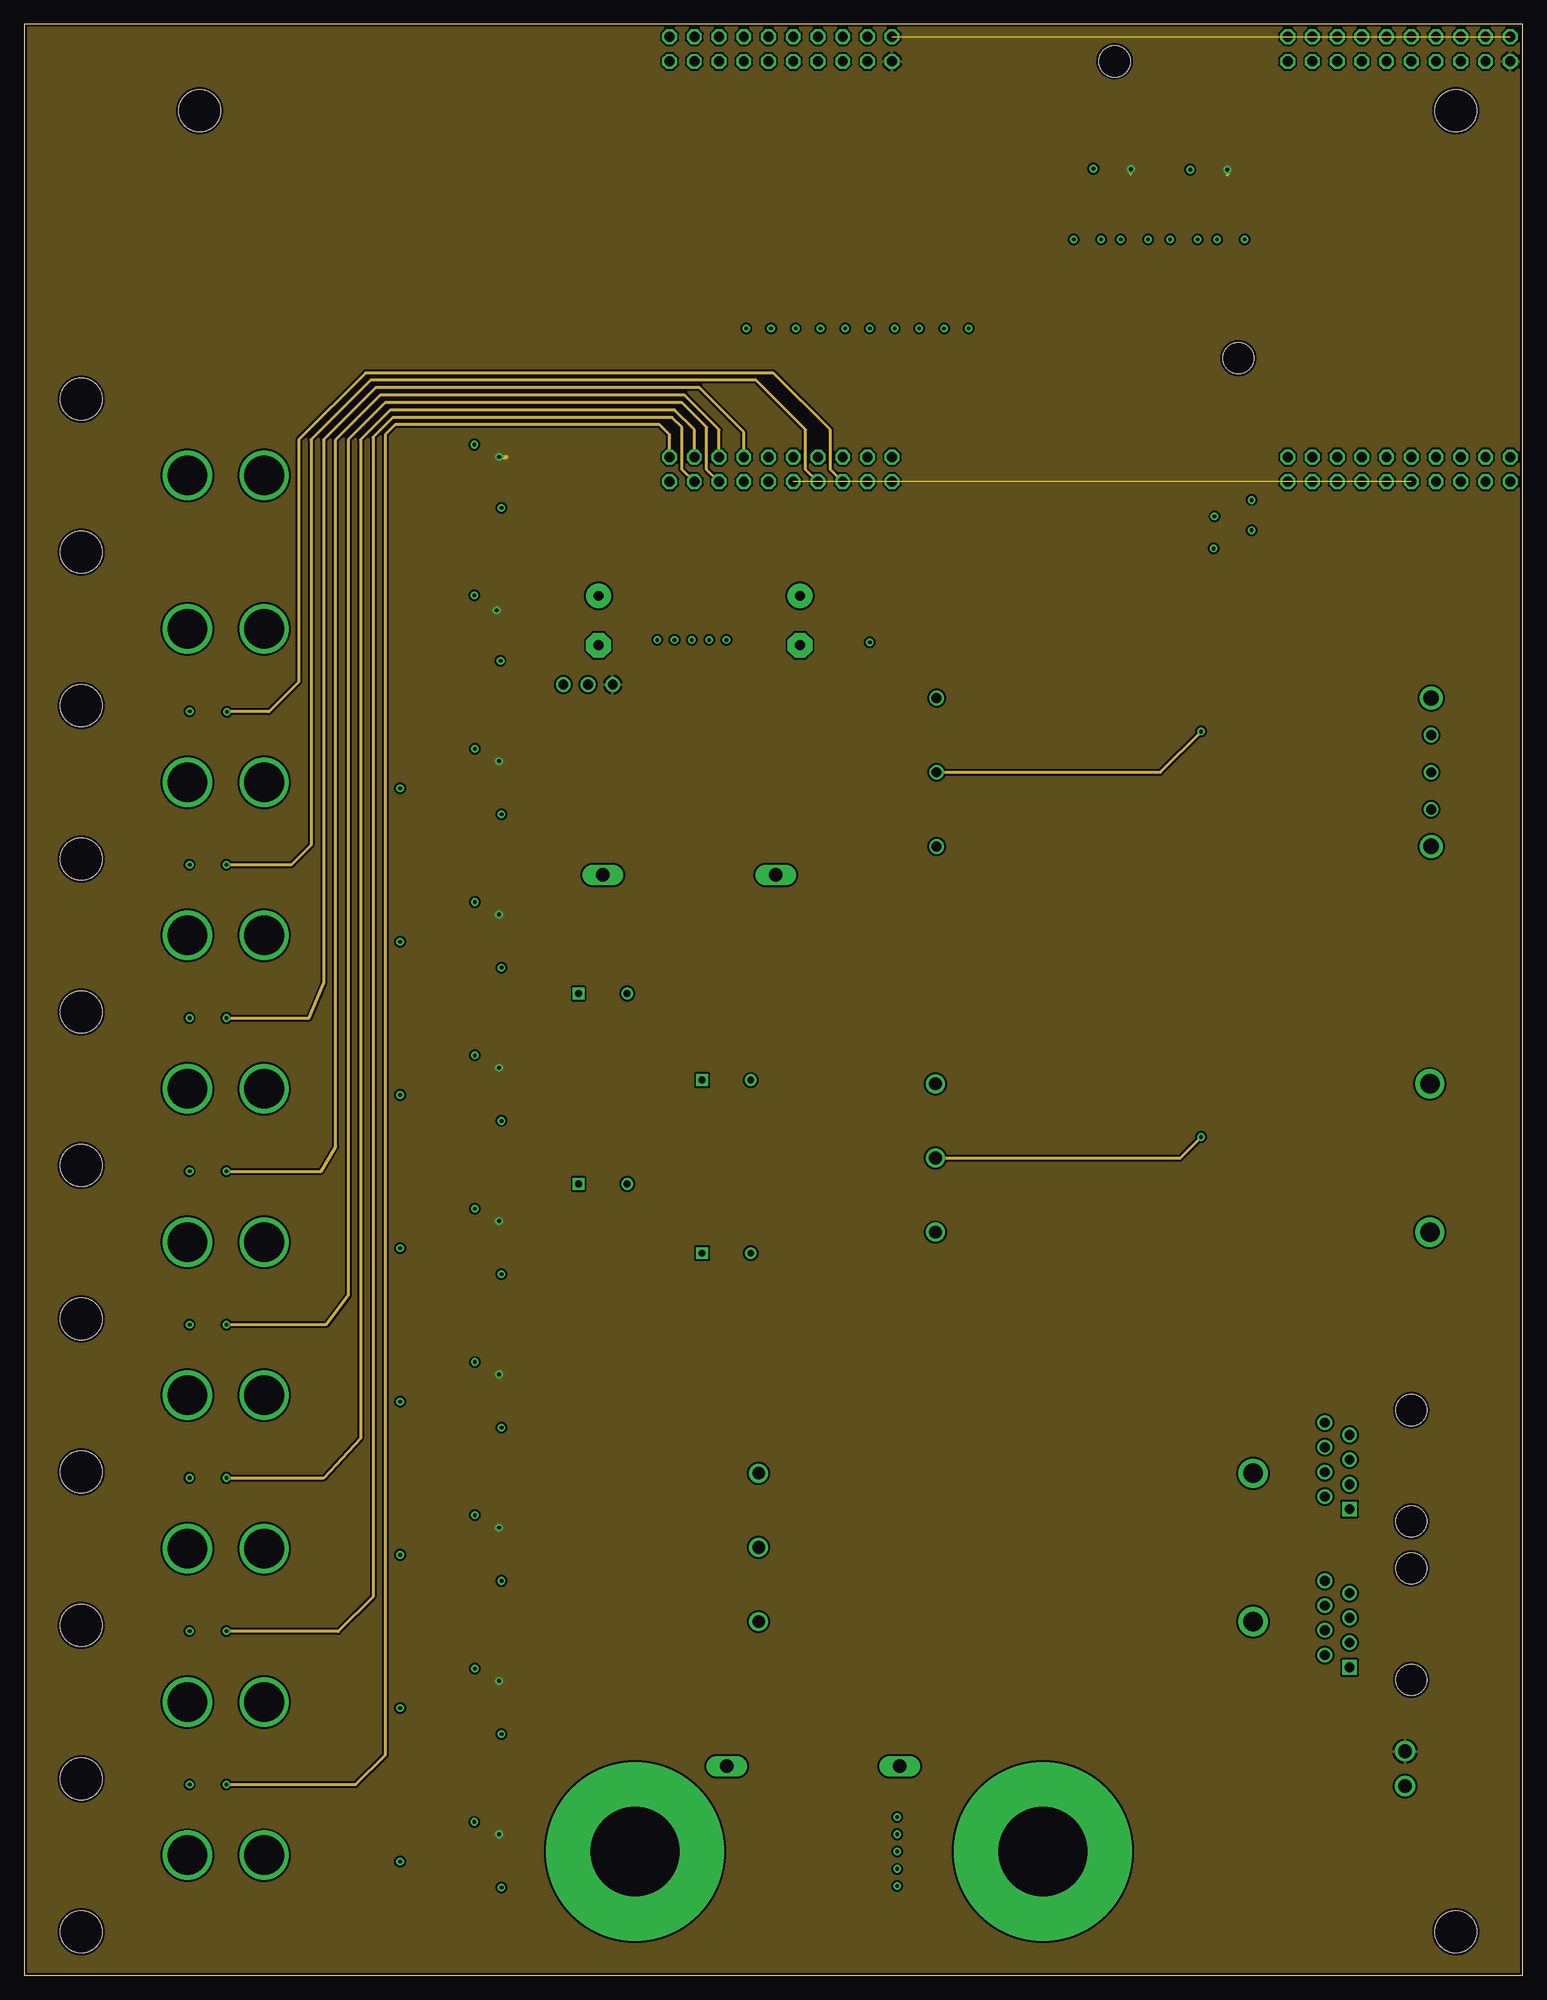
[diagram p4: board, inner layer Top-Mid]
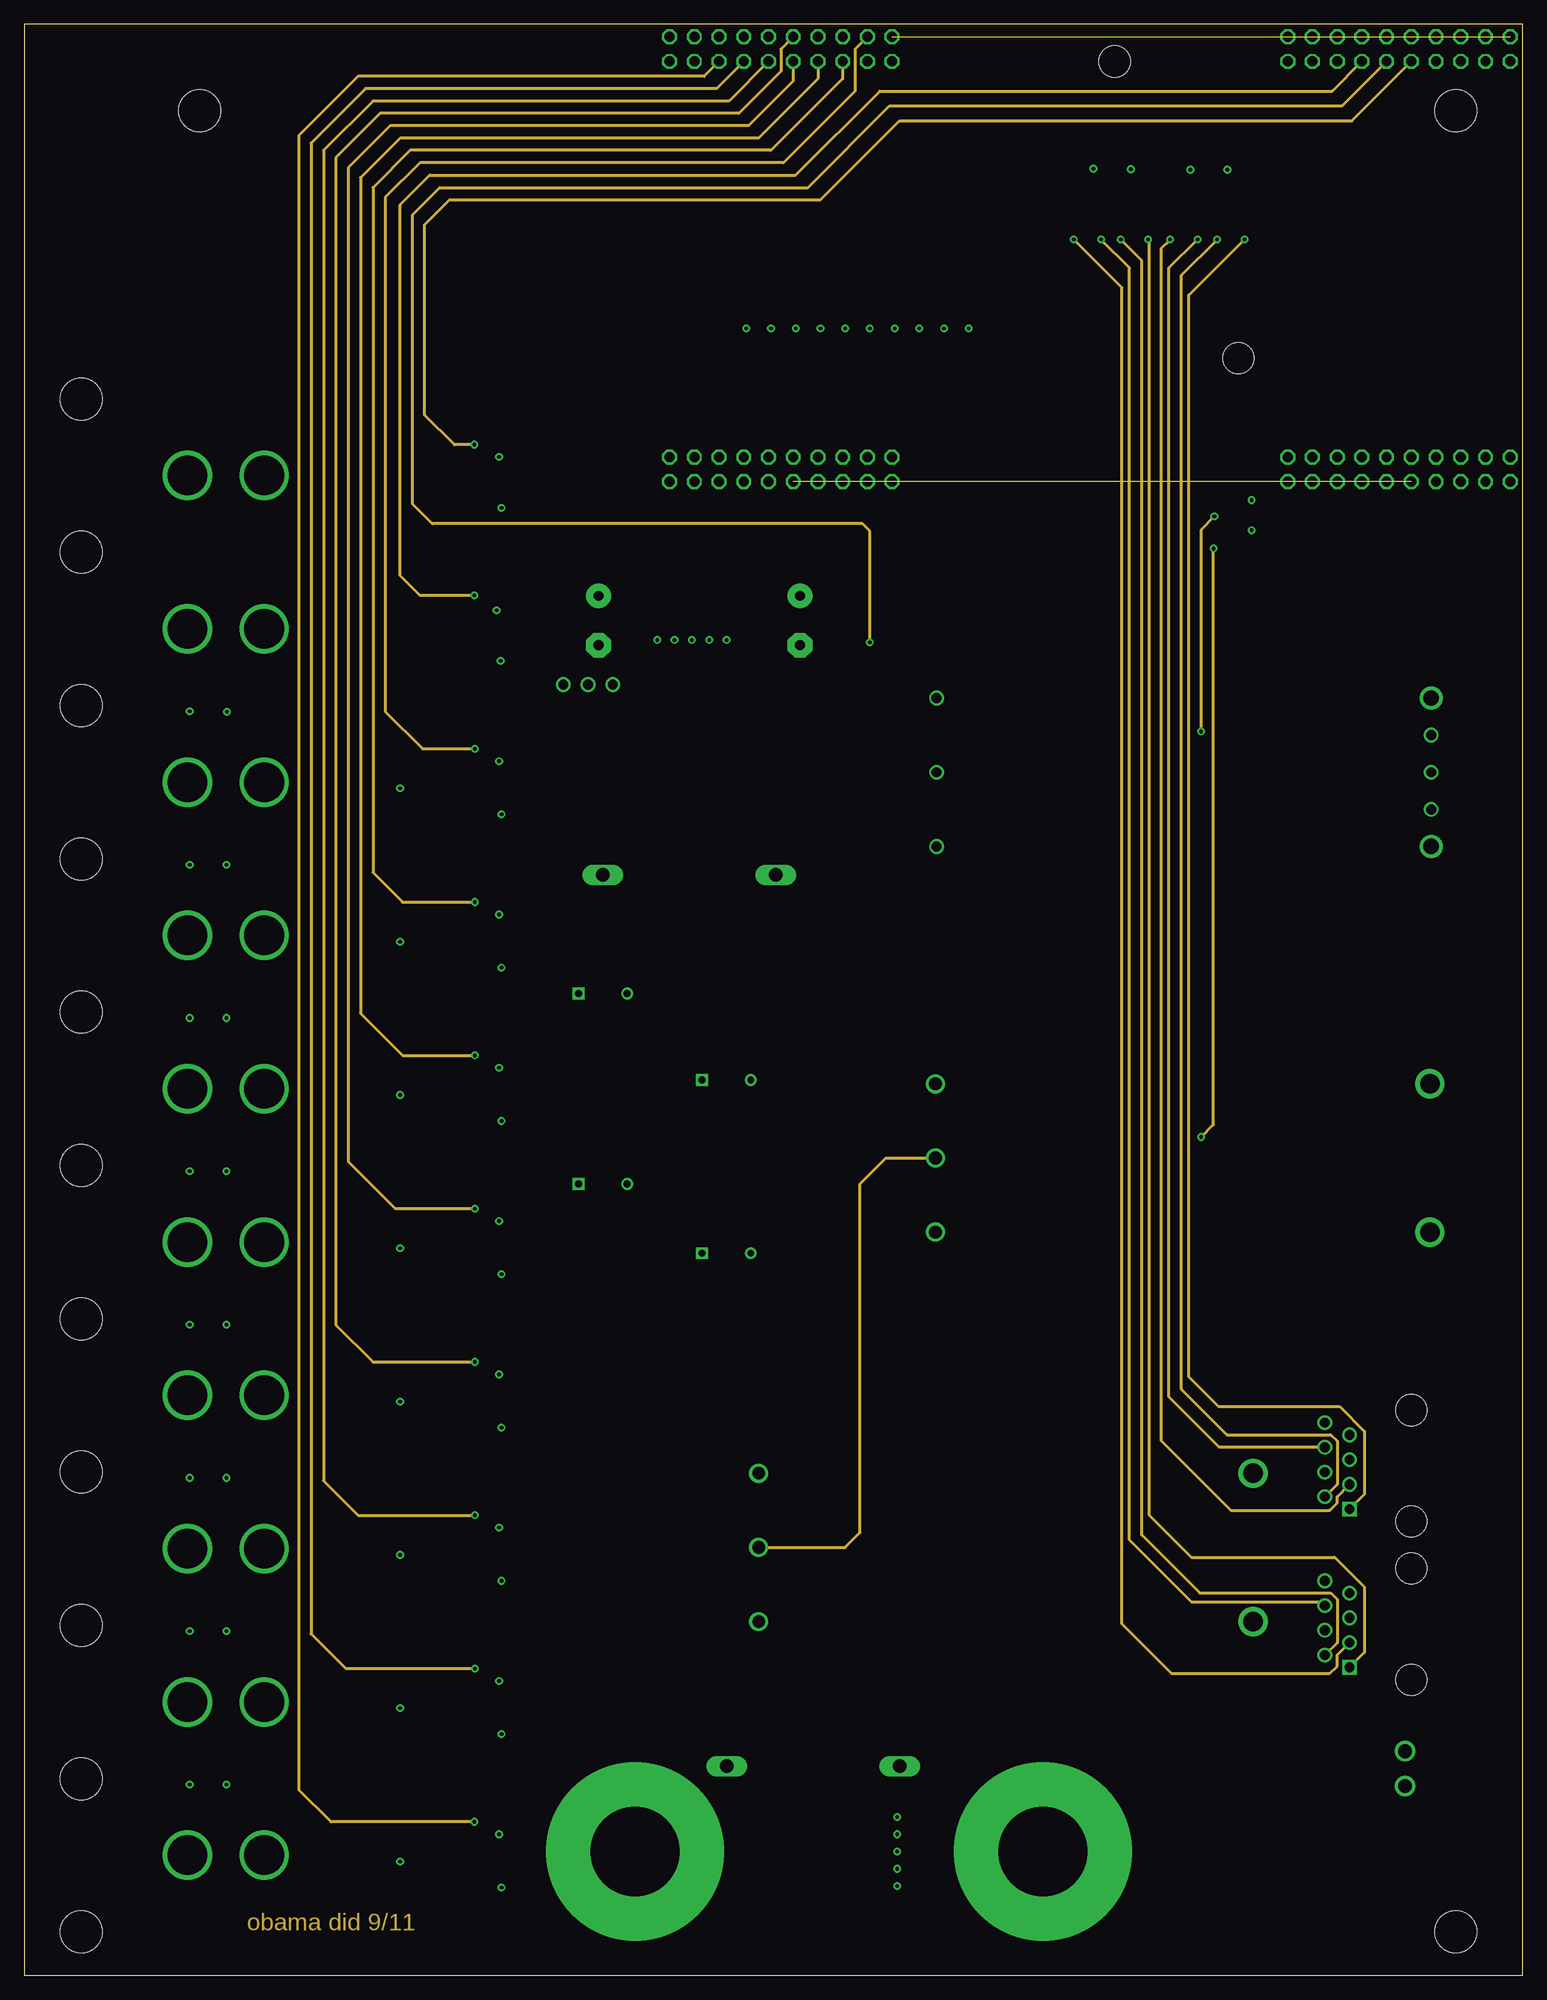
[diagram p5: board, inner layer Bot-Mid]
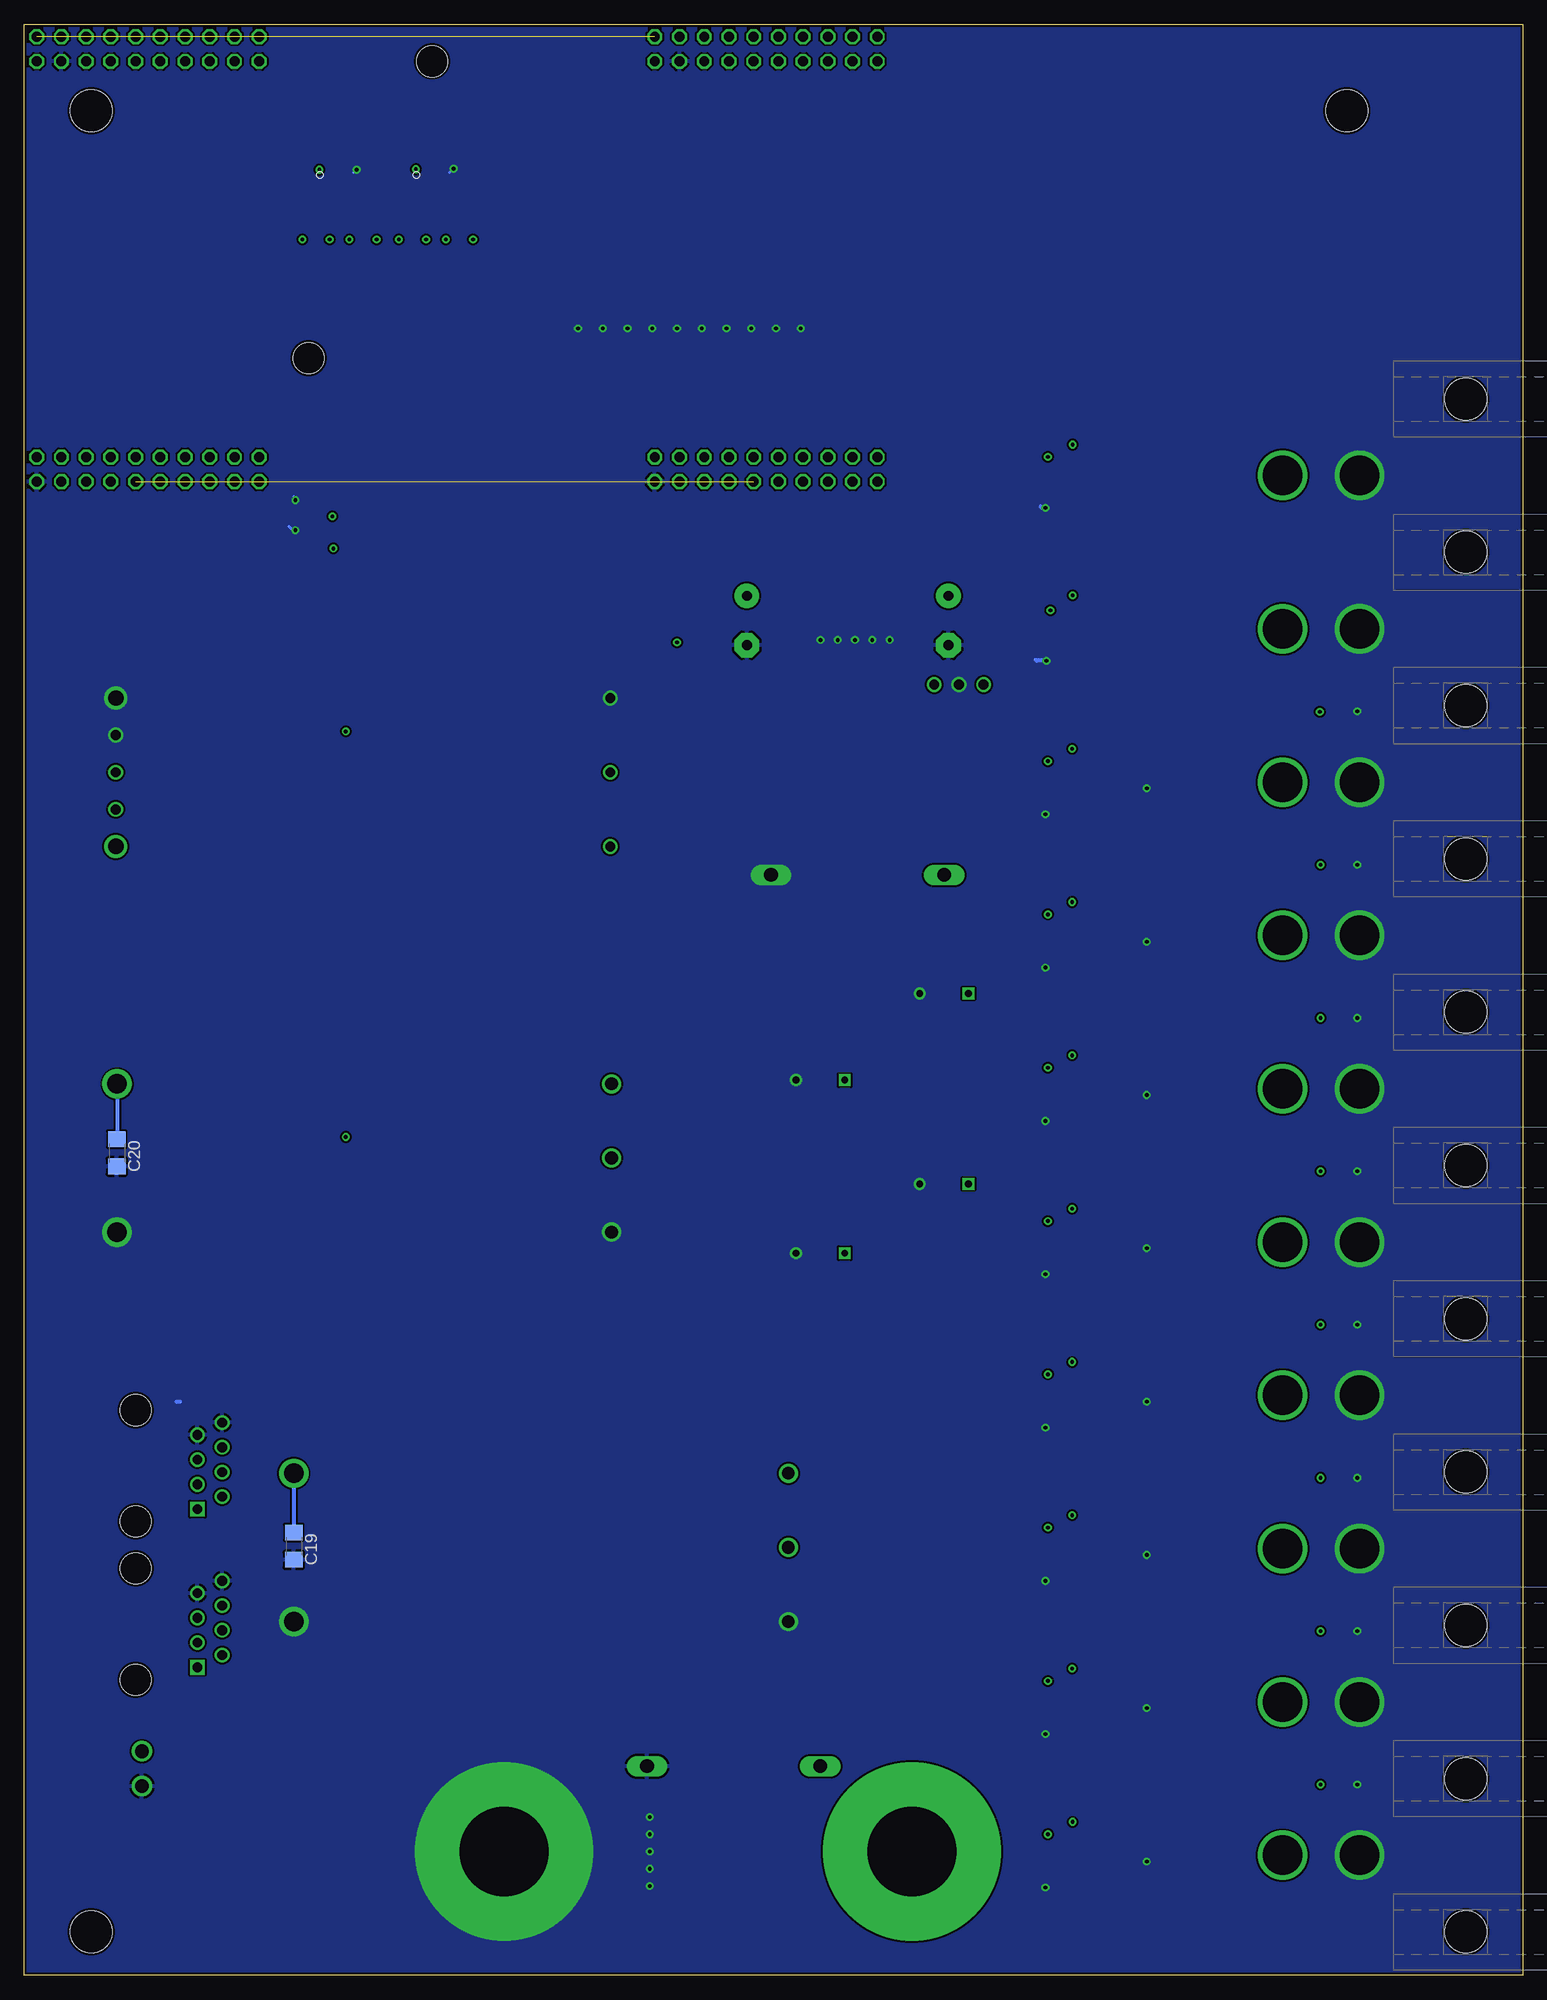
[diagram p6: board, bottom side, seen from below]

Size 153.92 x 200.41 mm. Coordinates in mm from the lower left corner, seen from the top.
Outline: 0,0 153.92,0 153.92,200.41 0,200.41 0,0
Copper layers (1*2*15*16): Top 0.035559375mm / dielectric 1.501140625mm / Top-Mid 0.035559375mm / dielectric 0.149859375mm / Bot-Mid 0.035559375mm / dielectric 0.200659375mm / Bottom 0.035559375mm
Design rules "typical_4pcb *": minimum track width 6mil, minimum drill 10mil, track to track 8mil, track to pad 8mil, pad to pad 8mil, via to via 8mil, smd to smd 8mil, copper to edge 10mil, drill to drill 8mil, minimum pad ring 10mil, minimum via ring 8mil, stop-mask expansion 4mil, vias tented up to drill 0mil, thermal gap 10mil
Holes 3.2 mm at 112.01,196.6 124.71,166.12

### Footprints (pad centres in the part's own frame; a part is rotated, then mirrored left to right if it is on the bottom)
691322110002 = drill 1.4: L -1.79,0; R 1.79,0
SOIC8_ACS711 = smd 1.92 x 2.2: 1 -1.27,-2.6; 4 1.27,-2.6 | smd 0.6 x 2.2: 5 1.905,2.6; 6 0.635,2.6; 7 -0.635,2.6; 8 -1.905,2.6
C1206 = smd 1.6 x 1.8: 1 -1.4,0; 2 1.4,0
LARGE_TERMINAL_HOLE = drill 9.144 pad 18.288: P$1 0,0
OKI-78SRH = drill 1.016: 1 2.54,0; 2 0,0; 3 -2.54,0
APP45_PCB_HORIZ_RIGHT = drill 4.064: P$1 28.194,3.937
C_12.5MM = drill 0.7 square: + -2.5,0 | drill 0.7: - 2.5,0
E5-8,5 = drill 1.016 pad 2.54: + -2.54,0 | drill 1.016 pad 2.54 octagon: - 2.54,0
CB429-17 = drill 1.397 long: A 8.89,0; C -8.89,0
D2PACK = smd 1.6 x 3.5: 1 -2.54,-8.275; 2 2.54,-8.275 | smd 12.2 x 9.75: TAB 0,2
U-T48-QB-NO_TRIM = drill 1.3: 1 -25.4,7.62; 2 -25.4,0; 3 -25.4,-7.62 | drill 2: 4 25.4,-7.62; 8 25.4,7.62
LED-1206 = smd 1.2 x 1.4: A -1.5,0; C 1.5,0
1206 = smd 1.6 x 1.8: 1 -1.4,0; 2 1.4,0
SO8 = smd 0.6 x 2.2: 1 -1.905,-2.6; 2 -0.635,-2.6; 3 0.635,-2.6; 4 1.905,-2.6; 5 1.905,2.6; 6 0.635,2.6; 7 -0.635,2.6; 8 -1.905,2.6
SOT323 = smd 0.7 x 0.7: 1 -0.65,-0.925; 2 0.65,-0.925; 3 0,0.925
R1206 = smd 1.6 x 1.803: 1 -1.422,0; 2 1.422,0
MURATA_5V_DC-DC_CONVERTER = drill 1.016: P$1 -24.13,-0.635; P$2 -24.13,6.985; P$3 -24.13,-8.255; P$4 26.67,-0.635; P$7 26.67,-4.445; P$8 26.67,3.175 | drill 1.575: P$5 26.67,6.985; P$6 26.67,-8.255
APP45_PCB_HORIZ_RIGHT_2HIGH = drill 4.064: P$2 36.068,3.937
TIVA-C-CONNECTED = drill 1.016 octagon: +3V3_1 59.69,54.61; +3V3_2 123.19,54.61; +5V_1 59.69,52.07; +5V_2 123.19,52.07; GND_1 57.15,52.07; GND_2 59.69,8.89; GND_3 120.65,52.07; GND_4 123.19,8.89; PA4 39.37,52.07; PA5 36.83,52.07; PA6 105.41,52.07; PA7 52.07,8.89; PB2 102.87,54.61; PB3 100.33,54.61; PB4 54.61,52.07; PB5 52.07,52.07; PC4 118.11,54.61; PC5 115.57,54.61; PC6 113.03,54.61; PC7 105.41,54.61; PD0 107.95,8.89; PD1 110.49,8.89; PD2 57.15,54.61; PD3 107.95,54.61; PD4 49.53,54.61; PD5 46.99,54.61; PD7 107.95,52.07; PE0 118.11,52.07; PE1 115.57,52.07; PE2 113.03,52.07; PE3 110.49,52.07; PE4 120.65,54.61; PE5 110.49,54.61; PF1 123.19,11.43; PF2 120.65,11.43; PF3 118.11,11.43; PG0 115.57,11.43; PG1 59.69,11.43; PH0 44.45,11.43; PH1 41.91,11.43; PH2 118.11,8.89; PH3 115.57,8.89; PK0 49.53,52.07; PK1 46.99,52.07; PK2 44.45,52.07; PK3 41.91,52.07; PK4 57.15,11.43; PK5 54.61,11.43; PK6 39.37,11.43; PK7 36.83,11.43; PL0 107.95,11.43; PL1 105.41,11.43; PL2 102.87,11.43; PL3 100.33,11.43; PL4 113.03,11.43; PL5 110.49,11.43; PM0 52.07,11.43; PM1 49.53,11.43; PM2 46.99,11.43; PM3 120.65,8.89; PM4 102.87,52.07; PM5 100.33,52.07; PM6 36.83,8.89; PM7 57.15,8.89; PN2 105.41,8.89; PN3 102.87,8.89; PN4 36.83,54.61; PN5 39.37,54.61; PP0 54.61,54.61; PP1 52.07,54.61; PP2 100.33,8.89; PP3 41.91,8.89; PP4 41.91,54.61; PP5 54.61,8.89; PQ0 44.45,54.61; PQ1 39.37,8.89; PQ2/PA3 46.99,8.89; PQ3/PA2 44.45,8.89; RST1 49.53,8.89; RST_2 113.03,8.89
APP45_MOUNTING_WING_HORIZ = hole 4.318: -7.366,3.937
FCI-54602-908LF = drill 1 square: 1 -4.445,6.35 | drill 1: 2 -3.175,8.89; 3 -1.905,6.35; 4 -0.635,8.89; 5 0.635,6.35; 6 1.905,8.89; 7 3.175,6.35; 8 4.445,8.89 | hole 3.2: -5.715,0; 5.715,0
#8_SCREW = hole 4.318: 0,0
MAX3070E = smd 0.49 x 1.3: A -1.905,2.857; B -0.635,2.857; DI 0.635,-2.857; GND 1.905,-2.857; RO -0.635,-2.857; VCC -1.905,-2.857; Y 1.905,2.857; Z 0.635,2.857

### Placement (x,y rotation side)
5V-INT  H_WR-TBL_321*0002HORIZ  [691322110002]  141.86,21.21 90 top
ACS714-M1  45.63,16.79 180 top
ACS714-M2  45.63,32.54 180 top
ACS714-M3  45.63,48.29 180 top
ACS714-M4  45.63,64.04 180 top
ACS714-M5  45.63,79.78 180 top
ACS714-M6  45.63,95.53 180 top
ACS714-M7  45.63,111.28 180 top
ACS714-M8  45.63,127.03 180 top
ACS714CAP-M1  47.55,10.44 90 top
ACS714CAP-M2  47.55,26.19 90 top
ACS714CAP-M3  47.55,41.94 90 top
ACS714CAP-M4  47.55,57.69 90 top
ACS714CAP-M5  47.55,73.43 90 top
ACS714CAP-M6  47.55,89.18 90 top
ACS714CAP-M7  47.55,104.93 90 top
ACS714CAP-M8  47.55,120.68 90 top
BATT-NEG  104.65,12.7 0 top
BATT-POS  62.74,12.7 0 top
BB-8-5V  57.91,132.59 180 top
BOTAPP-M1  -11.43,8.38 0 top
BOTAPP-M2  -11.43,24.13 0 top
BOTAPP-M3  -11.43,39.88 0 top
BOTAPP-M4  -11.43,55.63 0 top
BOTAPP-M5  -11.43,71.37 0 top
BOTAPP-M6  -11.43,87.12 0 top
BOTAPP-M7  -11.43,102.87 0 top
BOTAPP-M8  -11.43,118.62 0 top
C1  59.44,81.28 0 top
C2  72.14,91.95 0 top
C3  72.14,74.17 0 top
C4  59.44,100.84 0 top
C6  47.49,136.4 90 top
C11  47.5,152.15 90 top
C12  45.21,152.15 270 top
C13  97.03,166.12 90 top
C14  79.25,166.12 90 top
C15  89.41,166.12 90 top
C17  91.95,166.12 90 top
C18  86.87,9.14 0 top
C19  126.24,44.07 270 bottom
C20  144.41,84.47 270 bottom
C21  86.87,16.26 0 top
C22  86.87,12.7 0 top
C34  84.33,166.12 90 top
C43  45.21,136.4 270 top
C44  74.17,166.12 90 top
C45  79.69,139.16 270 top
C46  58.99,139.16 270 top
C47  65.02,134.11 90 top
C48  72.14,134.11 90 top
C49  68.58,134.11 90 top
C50  86.87,166.12 90 top
C51  81.79,166.12 90 top
C52  76.71,166.12 90 top
C53  94.49,166.12 90 top
D1  68.33,113.03 0 top
D2  81.06,21.46 0 top
FET-M1  34.04,19.3 270 top
FET-M2  34.04,35.05 270 top
FET-M3  34.04,50.8 270 top
FET-M4  34.04,66.55 270 top
FET-M5  34.04,82.3 270 top
FET-M6  34.04,98.04 270 top
FET-M7  34.04,113.79 270 top
FET-M8  34.04,129.54 270 top
FILTERCAP-M1  45.23,10.44 270 top
FILTERCAP-M2  45.23,26.19 270 top
FILTERCAP-M3  45.23,41.94 270 top
FILTERCAP-M4  45.23,57.69 270 top
FILTERCAP-M5  45.23,73.43 270 top
FILTERCAP-M6  45.23,89.18 270 top
FILTERCAP-M7  45.23,104.93 270 top
FILTERCAP-M8  45.23,120.68 270 top
FINN-12V  119,83.95 0 top
LED2  17.27,143.51 180 top
LED3  17.27,159.26 180 top
LED5  138.81,26.8 0 top
LED-M1  35.56,11.68 0 top
LED-M2  35.56,27.43 0 top
LED-M3  35.56,43.18 0 top
LED-M4  35.56,58.93 0 top
LED-M5  35.56,74.68 0 top
LED-M6  35.56,90.42 0 top
LED-M7  35.56,106.17 0 top
LED-M8  35.56,121.92 0 top
LEDRES-M1  30.23,11.68 0 top
LEDRES-M2  30.23,27.43 0 top
LEDRES-M3  30.23,43.18 0 top
LEDRES-M4  30.23,58.93 0 top
LEDRES-M5  30.23,74.68 0 top
LEDRES-M6  30.23,90.42 0 top
LEDRES-M7  30.23,106.17 0 top
LEDRES-M8  30.23,121.92 0 top
LT1910-M1  18.85,20.02 0 top
LT1910-M2  18.85,35.76 0 top
LT1910-M3  18.85,51.51 0 top
LT1910-M4  18.85,67.26 0 top
LT1910-M5  18.85,83.01 0 top
LT1910-M6  18.85,98.76 0 top
LT1910-M7  18.85,114.5 0 top
LT1910-M8  18.85,130.25 0 top
LT1910CAP-M1  14.99,20.07 90 top
LT1910CAP-M2  14.99,35.81 90 top
LT1910CAP-M3  14.99,51.56 90 top
LT1910CAP-M4  14.99,67.31 90 top
LT1910CAP-M5  14.99,83.06 90 top
LT1910CAP-M6  14.99,98.81 90 top
LT1910CAP-M7  14.99,114.55 90 top
LT1910CAP-M8  14.99,130.3 90 top
POE-12V  100.84,43.94 0 top
Q2  124.21,150.88 90 top
Q12  124.31,147.78 90 top
R1  114.05,178.31 180 top
R2  123.95,178.31 180 top
R3  85.6,133.86 270 top
R4  88.14,133.86 90 top
R6  109.22,178.31 180 top
R7  119.13,178.31 180 top
R8  22.78,159.28 180 top
R10  22.94,143.51 180 top
R11  129.29,150.11 0 top
R13  144.02,26.8 0 top
R15  129.32,147.29 0 top
REY-5V  117.86,124.21 0 top
TOPAPP-M1  -11.43,8.38 0 top
TOPAPP-M2  -11.43,24.13 0 top
TOPAPP-M3  -11.43,39.88 0 top
TOPAPP-M4  -11.43,55.63 0 top
TOPAPP-M5  -11.43,71.37 0 top
TOPAPP-M6  -11.43,87.12 0 top
TOPAPP-M7  -11.43,102.87 0 top
TOPAPP-M8  -11.43,118.62 0 top
U$1  29.46,144.53 0 top
U$2  13.21,118.62 180 bottom
U$3  45.62,158.5 180 top
U$4  13.21,134.37 180 bottom
U$5  142.49,52.32 90 top
U$6  142.49,36.07 90 top
U$8  147.07,4.45 0 top
U$10  18.03,191.52 0 top
U$11  147.07,191.52 0 top
U$12  111.76,183.64 180 top
U$21  45.62,142.8 180 top
U$22  [MRDT_LOGO]  124.97,15.24 0 top
U$24  121.67,183.64 180 top
U$25  13.21,165.86 180 bottom
U$26  -11.43,134.37 0 top
U$27  -11.43,150.11 0 top
U$28  -11.43,150.11 0 top
U$29  -11.43,134.37 0 top
U$30  13.21,55.63 180 bottom
U$31  13.21,39.88 180 bottom
U$32  13.21,102.87 180 bottom
U$33  13.21,8.38 180 bottom
U$34  13.21,24.13 180 bottom
U$35  13.21,87.12 180 bottom
U$41  13.21,150.11 180 bottom
U$42  13.21,71.37 180 bottom

### Tracks (layer width: path | path; a pad name or v marks a point on that pad's centre or on a via)
5V-AUX
  pour Top (no thermals): 33.27,158.24 43.74,158.24 45.06,159.56 45.06,162.26 41.96,165.35 30.23,165.35 21.34,156.46 21.34,152.4 22.61,151.13 26.16,151.13
12V-AUX
  pour Top (no thermals): 31.75,140.97 41.76,140.97 45.06,144.27 45.06,146.46 43.43,148.08 28.7,148.08 21.34,140.72 21.34,136.91 23.11,135.38 26.16,135.38
+5V  (via drill 0.38)
  Top 0.305: 5V-INT.R 141.86,24.51 141.48,24.89 137.67,24.89 137.41,25.15 137.41,26.69 LED5.A | ACS714-M1.8 47.43,14.48 v48.77,14.48 | ACS714-M2.8 47.43,30.23 v48.77,30.23 | ACS714-M3.8 47.43,45.97 v48.77,45.97 | ACS714-M4.8 47.43,61.72 v48.77,61.72 | ACS714-M5.8 47.43,77.47 v48.77,77.47 | ACS714-M6.8 47.43,93.22 v48.77,93.22 | ACS714-M7.8 47.43,108.97 v48.77,108.97 | ACS714-M8.8 47.43,124.71 v48.77,124.71 | U$12.VCC 113.67,185.55 v113.69,185.52 | U$24.VCC 123.57,185.5 v123.6,185.47
  Top 0.406: ACS714-M1.8 47.54,11.86 ACS714CAP-M1.2 | ACS714-M2.8 47.54,27.61 ACS714CAP-M2.2 | ACS714-M3.8 47.54,43.35 ACS714CAP-M3.2 | ACS714-M4.8 ACS714CAP-M4.2 | ACS714-M5.8 47.54,74.85 ACS714CAP-M5.2 | ACS714-M6.8 47.54,90.6 ACS714CAP-M6.2 | ACS714-M7.8 47.54,106.34 ACS714CAP-M7.2 | ACS714-M8.8 47.54,122.09 ACS714CAP-M8.2 | 47.52,137.84 U$21.8 47.79,140.21 v48.51,140.21 | U$3.8 47.52,153.57 C11.2 47.5,155.96 v48.77,155.96
  Top 0.508: 47.52,137.84 C6.2
  Top-Mid 0.305: v113.69,185.52 113.64,185.01 | v123.6,185.47 123.62,184.96 123.57,184.91
  Top-Mid 0.406: v48.77,155.96 49.53,155.96
  pour Top-Mid: -20.07,207.77 167.64,207.77 167.64,-11.68 -20.07,-11.68
  pour Top: 59.69,131.32 73.66,131.32 73.66,133.35 61.72,133.35 61.21,133.86 59.69,133.86 59.18,133.35 59.18,131.83
DRAIN-M1
  Top 0.406: FET-M1.TAB 23.11,19.3 21.48,20.94 19.47,20.94 | 19.47,20.94 16.93,20.94 | 16.93,20.94 15.24,20.94 14.99,21.08 LT1910CAP-M1.2 | LT1910-M1.8 16.93,22.54 16.93,20.94 | LT1910-M1.6 19.47,22.54 19.47,20.94
  pour Top (no thermals): 30.73,25.4 30.73,13.21 41.79,13.21 42.67,14.22 42.67,16 44.45,16 45.14,16.69 45.14,21.16 41.15,25.4
DRAIN-M2
  Top 0.406: FET-M2.TAB 23.11,35.05 21.48,36.69 19.47,36.69 | 19.47,36.69 16.93,36.69 | 16.93,36.69 15.24,36.69 14.99,36.83 LT1910CAP-M2.2 | LT1910-M2.8 16.93,38.29 16.93,36.69 | LT1910-M2.6 19.47,38.29 19.47,36.69
  pour Top (no thermals): 30.73,41.15 30.73,28.96 41.79,28.96 42.67,29.97 42.67,31.75 44.45,31.75 45.14,32.44 45.14,36.91 41.15,41.15
DRAIN-M3
  Top 0.406: FET-M3.TAB 23.11,50.8 21.48,52.44 19.47,52.44 | 19.47,52.44 16.93,52.44 | 16.93,52.44 15.24,52.44 14.99,52.58 LT1910CAP-M3.2 | LT1910-M3.8 16.93,54.03 16.93,52.44 | LT1910-M3.6 19.47,54.03 19.47,52.44
  pour Top (no thermals): 30.73,56.9 30.73,44.7 41.79,44.7 42.67,45.72 42.67,47.5 44.45,47.5 45.14,48.18 45.14,52.65 41.15,56.9
DRAIN-M4
  Top 0.406: FET-M4.TAB 23.11,66.55 21.48,68.18 19.47,68.18 | 19.47,68.18 16.93,68.18 | 16.93,68.18 15.24,68.18 14.99,68.33 LT1910CAP-M4.2 | LT1910-M4.8 16.93,69.78 16.93,68.18 | LT1910-M4.6 19.47,69.78 19.47,68.18
  pour Top (no thermals): 30.73,72.64 30.73,60.45 41.79,60.45 42.67,61.47 42.67,63.25 44.45,63.25 45.14,63.93 45.14,68.4 41.15,72.64
DRAIN-M5
  Top 0.406: FET-M5.TAB 23.11,82.3 21.48,83.93 19.47,83.93 | 19.47,83.93 16.93,83.93 | 16.93,83.93 15.24,83.93 14.99,84.07 LT1910CAP-M5.2 | LT1910-M5.8 16.93,85.53 16.93,83.93 | LT1910-M5.6 19.47,85.53 19.47,83.93
  pour Top (no thermals): 30.73,88.39 30.73,76.2 41.79,76.2 42.67,77.22 42.67,78.99 44.45,78.99 45.14,79.68 45.14,84.15 41.15,88.39
DRAIN-M6
  Top 0.406: FET-M6.TAB 23.11,98.04 21.48,99.68 19.47,99.68 | 19.47,99.68 16.93,99.68 | 16.93,99.68 15.24,99.68 14.99,99.82 LT1910CAP-M6.2 | LT1910-M6.8 16.93,101.28 16.93,99.68 | LT1910-M6.6 19.47,101.28 19.47,99.68
  pour Top (no thermals): 30.73,104.14 30.73,91.95 41.79,91.95 42.67,92.96 42.67,94.74 44.45,94.74 45.14,95.43 45.14,99.9 41.15,104.14
DRAIN-M7
  Top 0.406: FET-M7.TAB 23.11,113.79 21.48,115.43 19.47,115.43 | 19.47,115.43 16.93,115.43 | 16.93,115.43 15.24,115.43 14.99,115.57 LT1910CAP-M7.2 | LT1910-M7.8 16.93,117.03 16.93,115.43 | LT1910-M7.6 19.47,117.03 19.47,115.43
  pour Top (no thermals): 30.73,119.89 30.73,107.7 41.79,107.7 42.67,108.71 42.67,110.49 44.45,110.49 45.14,111.18 45.14,115.65 41.15,119.89
DRAIN-M8
  Top 0.406: FET-M8.TAB 23.11,129.54 21.48,131.18 19.47,131.18 | 19.47,131.18 16.93,131.18 | 16.93,131.18 15.24,131.18 14.99,131.32 LT1910CAP-M8.2 | LT1910-M8.8 16.93,132.78 16.93,131.18 | LT1910-M8.6 19.47,132.78 19.47,131.18
  pour Top (no thermals): 30.73,135.64 30.73,123.44 41.79,123.44 42.67,124.46 42.67,126.24 44.45,126.24 45.14,126.92 45.14,131.39 41.15,135.64
FILTER-M1
  Top 0.406: ACS714-M1.6 45,12.08 FILTERCAP-M1.1
FILTER-M2
  Top 0.406: ACS714-M2.6 45,27.82 FILTERCAP-M2.1
FILTER-M3
  Top 0.406: ACS714-M3.6 45,43.57 FILTERCAP-M3.1
FILTER-M4
  Top 0.406: ACS714-M4.6 45,59.32 FILTERCAP-M4.1
FILTER-M5
  Top 0.406: ACS714-M5.6 45,75.07 FILTERCAP-M5.1
FILTER-M6
  Top 0.406: ACS714-M6.6 45,90.82 FILTERCAP-M6.1
FILTER-M7
  Top 0.406: ACS714-M7.6 45,106.56 FILTERCAP-M7.1
FILTER-M8
  Top 0.406: ACS714-M8.6 45,122.31 FILTERCAP-M8.1
GATE-M1
  Top 0.406: FET-M1.1 21.52,21.84 LT1910-M1.5
GATE-M2
  Top 0.406: FET-M2.1 21.52,37.59 LT1910-M2.5
GATE-M3
  Top 0.406: FET-M3.1 21.52,53.34 LT1910-M3.5
GATE-M4
  Top 0.406: FET-M4.1 21.52,69.09 LT1910-M4.5
GATE-M5
  Top 0.406: FET-M5.1 21.52,84.84 LT1910-M5.5
GATE-M6
  Top 0.406: FET-M6.1 21.52,100.58 LT1910-M6.5
GATE-M7
  Top 0.406: FET-M7.1 21.52,116.33 LT1910-M7.5
GATE-M8
  Top 0.406: FET-M8.1 21.52,132.08 LT1910-M8.5
GND  (via drill 0.38)
  Top 0.305: R4.1 88.14,131.32 88.27,131.19 REY-5V.P$2 | R13.2 145.42,20.7 144.13,19.42 5V-INT.L | U$12.GND 109.86,185.6 v109.83,185.57 | U$24.GND 119.76,186.06 v119.79,185.47 | Q12.2 126.08,148.43 v126.09,148.44 | Q2.2 126.08,151.53 v126.09,151.54 | LED3.C 15.77,155.04 U$28.P$1 | LED2.C 15.77,139.29 U$29.P$1
  Top 0.406: v49.02,9.02 v49.02,9.01 ACS714CAP-M1.1 FILTERCAP-M1.2 | ACS714-M1.5 43.73,10.29 FILTERCAP-M1.2 | LED-M1.C v38.61,11.68 | LT1910CAP-M1.1 15.69,18.67 LT1910-M1.1 16.98,17.45 v16.98,19.58 | v49.02,24.77 v49.02,24.76 ACS714CAP-M2.1 FILTERCAP-M2.2 | ACS714-M2.5 43.73,26.04 FILTERCAP-M2.2 | LED-M2.C v38.61,27.43 | LT1910CAP-M2.1 15.69,34.41 LT1910-M2.1 16.98,33.2 v16.98,35.33 | v49.02,40.51 ACS714CAP-M3.1 FILTERCAP-M3.2 | ACS714-M3.5 43.73,41.79 FILTERCAP-M3.2 | LED-M3.C v38.61,43.18 | LT1910CAP-M3.1 15.69,50.16 LT1910-M3.1 16.98,48.95 v16.98,51.08 | v49.02,56.26 ACS714CAP-M4.1 FILTERCAP-M4.2 | ACS714-M4.5 43.73,57.54 FILTERCAP-M4.2 | LED-M4.C v38.61,58.93 | LT1910CAP-M4.1 15.69,65.91 LT1910-M4.1 16.98,64.7 v16.98,66.83 | v49.02,72.01 ACS714CAP-M5.1 FILTERCAP-M5.2 | ACS714-M5.5 43.73,73.28 FILTERCAP-M5.2 | LED-M5.C v38.61,74.68 | LT1910CAP-M5.1 15.69,81.66 LT1910-M5.1 16.98,80.44 v16.98,82.58 | v49.02,87.76 v49.02,87.75 ACS714CAP-M6.1 FILTERCAP-M6.2 | ACS714-M6.5 43.73,89.03 FILTERCAP-M6.2 | LED-M6.C v38.61,90.42 | LT1910CAP-M6.1 15.69,97.41 LT1910-M6.1 16.98,96.19 v16.98,98.32 | v49.02,103.5 ACS714CAP-M7.1 FILTERCAP-M7.2 | ACS714-M7.5 43.73,104.78 FILTERCAP-M7.2 | LED-M7.C v38.61,106.17 | LT1910CAP-M7.1 15.69,113.15 LT1910-M7.1 16.98,111.94 v16.98,114.07 | v49.02,119.25 ACS714CAP-M8.1 FILTERCAP-M8.2 | ACS714-M8.5 43.73,120.53 FILTERCAP-M8.2 | LED-M8.C v38.61,121.92 | LT1910CAP-M8.1 15.69,128.9 LT1910-M8.1 16.98,127.69 v16.98,129.82 | FILTERCAP-M1.2 | FILTERCAP-M2.2 | FILTERCAP-M3.2 | FILTERCAP-M4.2 | FILTERCAP-M5.2 | FILTERCAP-M6.2 | FILTERCAP-M7.2 | FILTERCAP-M8.2 | U$21.5 43.71,136.5 C43.2 | U$3.5 43.71,152.25 C12.2
  Top 0.406: C12.2 C11.1 | C43.2 C6.1 | C43.2 48.89,135 v48.92,135.03 | C12.2 49,150.75 v49.02,150.72
  Bottom 0.305: v109.83,185.57 110.24,185.17 | v119.79,185.47 120.14,185.17 | v126.09,148.44 126.34,148.44 126.75,148.84 | v126.09,151.54 126.09,151.74 126.24,151.89
  Bottom 0.406: 138.3,58.93 137.92,58.93 | v48.92,135.03 49.94,135.03 50.04,135.13 | v49.02,150.72 49.38,150.72 49.53,150.88
  other vias: 89.66,9.14 89.66,10.92 89.66,12.7 89.66,14.48 89.66,16.26 72.14,137.16 70.36,137.16 68.58,137.16 66.8,137.16 65.02,137.16 74.17,169.16 76.71,169.16 79.25,169.16 81.79,169.16 84.33,169.16 86.87,169.16 89.41,169.16 91.95,169.16 94.49,169.16 97.03,169.16
  pour Bottom (rank 2): -0.51,-2.54 158.24,-2.54 158.24,205.74 -0.51,205.74
  pour Bottom (no thermals): 73.15,117.09 83.31,117.09 83.31,108.71 73.15,108.71
  pour Bottom (no thermals): 59.94,103.89 79.5,103.89 79.5,65.28 59.94,65.28
  pour Bottom (no thermals): 56.64,133.1 56.39,133.1 57.15,131.57 58.67,131.57 59.18,132.08 59.18,133.1 58.67,133.6 57.15,133.6
  pour Top: 87.38,17.78 87.38,7.62 90.17,7.62 90.17,17.78
  pour Top: 63.5,134.87 73.66,134.87 73.66,137.67 63.5,137.67
  pour Top: 73.15,169.67 73.15,166.62 98.04,166.62 98.04,169.67
IMEAS-5V  (via drill 0.38)
  Top 0.305: U$3.7 46.25,154.97 v46.23,157.23
  Bot-Mid 0.305: v46.23,157.23 44.2,157.23 41.15,160.27 41.15,179.83 43.69,182.37 81.79,182.37 89.92,190.5 136.4,190.5 U$1.PE2
IMEAS-12V  (via drill 0.38)
  Top 0.305: U$21.7 46.25,141.71 v46.23,141.73
  Bot-Mid 0.305: v46.23,141.73 40.64,141.73 38.61,143.76 38.61,181.86 41.66,184.91 79.25,184.91 87.88,193.55 134.37,193.55 U$1.PD7
IMEAS-M1  (via drill 0.38)
  Top 0.305: ACS714-M1.7 46.27,15.71 v46.23,15.75
  Top 0.406: 46.28,15.75 46.27,15.74 ACS714-M1.7
  Bot-Mid 0.305: U$1.PK3 69.85,195.07 34.29,195.07 28.19,188.98 28.19,19.05 31.5,15.75 v46.23,15.75
IMEAS-M2  (via drill 0.38)
  Top 0.406: v46.28,31.5 46.27,31.23 ACS714-M2.7
  Bot-Mid 0.305: U$1.PK2 71.12,193.8 35.05,193.8 29.46,188.21 29.46,35.05 33.02,31.5 v46.28,31.5
IMEAS-M3  (via drill 0.38)
  Top 0.406: v46.28,47.24 46.27,47.23 ACS714-M3.7
  Bot-Mid 0.305: U$1.PK1 72.39,192.53 35.81,192.53 30.73,187.45 30.73,50.8 34.29,47.24 v46.28,47.24
IMEAS-M4  (via drill 0.38)
  Top 0.406: v46.28,62.99 46.27,62.73 ACS714-M4.7
  Bot-Mid 0.305: U$1.PD4 77.72,197.87 77.72,195.58 73.41,191.26 36.58,191.26 32,186.69 32,66.8 35.81,62.99 v46.28,62.99
IMEAS-M5  (via drill 0.38)
  Top 0.406: v46.28,78.74 46.27,78.48 ACS714-M5.7
  Bot-Mid 0.305: U$1.PK0 78.99,194.56 74.42,189.99 37.59,189.99 33.27,185.67 33.27,83.57 38.1,78.74 v46.28,78.74
IMEAS-M6  (via drill 0.38)
  Top 0.406: v46.28,94.49 46.27,94.22 ACS714-M6.7
  Bot-Mid 0.305: U$1.PB5 81.53,194.82 75.44,188.72 38.61,188.72 34.54,184.66 34.54,98.81 38.86,94.49 v46.28,94.49
IMEAS-M7  (via drill 0.38)
  Top 0.406: v46.28,110.24 46.27,110.23 ACS714-M7.7
  Bot-Mid 0.305: U$1.PB4 84.07,194.82 76.71,187.45 39.62,187.45 35.81,183.64 35.81,113.28 38.86,110.24 v46.28,110.24
IMEAS-M8  (via drill 0.38)
  Top 0.406: v46.28,125.98 46.27,125.72 ACS714-M8.7
  Bot-Mid 0.305: U$1.PD2 85.34,197.87 85.34,193.55 77.98,186.18 40.64,186.18 37.08,182.63 37.08,129.79 40.89,125.98 v46.28,125.98
LEDLINE-M1
  Top 0.406: LEDRES-M1.2 LED-M1.A
LEDLINE-M2
  Top 0.406: LEDRES-M2.2 LED-M2.A
LEDLINE-M3
  Top 0.406: LEDRES-M3.2 LED-M3.A
LEDLINE-M4
  Top 0.406: LEDRES-M4.2 LED-M4.A
LEDLINE-M5
  Top 0.406: LEDRES-M5.2 LED-M5.A
LEDLINE-M6
  Top 0.406: LEDRES-M6.2 LED-M6.A
LEDLINE-M7
  Top 0.406: LEDRES-M7.2 LED-M7.A
LEDLINE-M8
  Top 0.406: LEDRES-M8.2 LED-M8.A
N$4  (via drill 0.38)
  Top 0.305: v122.17,146.56 v122.17,146.57 Q12.3
  Top-Mid 0.305: FINN-12V.2 118.75,83.95 v120.9,86.11
  Bot-Mid 0.305: POE-12V.2 84.33,43.94 85.85,45.47 85.85,81.28 88.52,83.95 FINN-12V.2 | v120.9,86.11 122.17,87.38 v122.17,146.56
N$6
  Top 0.305: LED5.C R13.1
N$12
  Top 0.406: U$21.6 44.98,138.03
  Top 0.508: 44.98,138.03 C43.1
N$33
  Top 0.305: C46.+ 58.96,141.7 56.13,144.53 | C45.+ 79.69,144.08 79.25,144.53
  Top 7.62: 126.24,91.19 126.24,114.55 96.27,144.53 79.25,144.53 56.13,144.53 54.86,144.53 | 126.24,91.19 126.62,91.57 137.03,91.57 | 126.24,91.19 126.24,60.71
  Bottom 0.406: FINN-12V.8 144.4,85.89 C20.1 | POE-12V.8 C19.1
  pour Top (no thermals): 122.68,60.71 122.68,49.78 124.21,48.26 128.27,48.26 129.79,49.78 129.79,60.71
  pour Top (no thermals): 136.65,95.12 145.41,95.12 147.57,92.96 147.57,90.04 145.54,88.01 135.76,88.01 135.13,88.65 135.13,93.6
  pour Top (no thermals): 55.88,148.08 47.7,148.08 46.18,146.56 46.18,144.32 49.53,140.97 55.88,140.97 56.64,141.73 56.64,147.32
N$34
  Top 0.305: R8.2 18.8,159.28 LED3.A
N$38
  Top 0.406: U$3.6 44.98,153.78 C12.1
N$43  (via drill 0.38)
  Top 0.305: v122.27,149.86 Q2.3
  Top-Mid 0.305: REY-5V.P$1 116.71,123.57 v120.9,127.76
  Bot-Mid 0.305: v120.9,127.76 120.9,148.5 v122.27,149.86
N$46
  Top 0.305: R10.2 LED2.A
N$48
  Top 0.305: Q2.1 127.75,150.23 R11.1
N$71
  Top 0.305: C44.1 C52.1 C14.1 C51.1 C34.1 C50.1 C15.1 C17.1 C53.1 C13.1 97.03,161.8
  Top 1.27: REY-5V.P$6 REY-5V.P$7 136.65,123.95
  Top 7.62: 136.65,123.95 98.81,161.8 97.03,161.8 53.59,161.8
  pour Top (no thermals): 54.86,165.35 49.23,165.35 46.18,162.31 46.18,159.56 47.5,158.24 55.12,158.24 55.88,159 55.88,164.34
  pour Top (no thermals): 129.54,125.98 141.99,113.54 146.56,113.54 147.57,114.55 147.57,120.14 145.8,121.92 143.76,121.92 136.14,129.54 133.1,129.54
N$98  (1 unrouted)
N$100  (1 unrouted)
N$114
  Top 0.305: Q12.1 127.73,147.13 R15.1
REC+  (via drill 0.38)
  Top 0.305: R1.1 113.67,180.09 U$12.A
  Bot-Mid 0.305: U$6.1 137.67,33.15 137.67,39.88 134.62,42.93 119.89,42.93 115.57,47.24 115.57,178.18 R1.1
  other vias: 115.45,178.31
REC+1  (via drill 0.38)
  Top 0.305: R2.1 123.57,180.09 U$24.A
  Bot-Mid 0.305: U$5.1 137.67,49.4 137.67,55.88 135.13,58.42 122.68,58.42 119.63,61.47 119.63,172.59 R2.1
  other vias: 125.35,178.31
REC-  (via drill 0.38)
  Top 0.305: R1.2 112.39,178.56 U$12.B
  Bot-Mid 0.305: U$6.2 134.87,34.16 134.87,38.61 134.21,39.27 120.75,39.27 114.81,45.21 114.81,176.15 R1.2
  other vias: 112.65,178.31
REC-1  (via drill 0.38)
  Top 0.305: R2.2 122.3,178.56 U$24.B
  Bot-Mid 0.305: U$5.2 134.87,50.42 134.87,54.86 134.21,55.52 123.55,55.52 118.87,60.2 118.87,174.63 R2.2
  other vias: 122.55,178.31
RX1
  Top 0.305: 122.33,186.53 U$24.RO
  Top 0.406: 122.33,186.53 122.33,187.1 122.94,187.71 138.43,187.71 146.3,195.58 146.3,197.87 U$1.PC4
RX2
  Top 0.406: U$1.PP0 85.34,197.87 103.38,197.87 112.39,188.85 U$12.RO
SIG-5V
  Top 0.305: R11.2 130.71,152.5 U$1.PP2
SIG-12V
  Top 0.305: R15.2 132.33,148.88 U$1.PN3
SIG-M1  (via drill 0.38)
  Top 0.406: v20.75,19.58 LT1910-M1.4
  Top-Mid 0.305: U$1.PK7 66.29,157.99 66.29,158.24 65.28,159.26 38.1,159.26 37.08,158.24 37.08,22.61 34.06,19.58 v20.75,19.58
SIG-M2  (via drill 0.38)
  Top 0.406: v20.75,35.33 LT1910-M2.4
  Top-Mid 0.305: U$1.PQ1 67.56,154.69 67.56,159 66.55,160.02 37.85,160.02 35.81,157.99 35.81,38.86 32.26,35.31 20.78,35.31 v20.75,35.33
SIG-M3  (via drill 0.38)
  Top 0.406: v20.75,51.08 LT1910-M3.4
  Top-Mid 0.305: U$1.PK6 68.83,158.75 66.8,160.78 37.59,160.78 34.54,157.73 34.54,55.12 30.73,51.05 20.78,51.05 v20.75,51.08
SIG-M4  (via drill 0.38)
  Top 0.406: v20.75,66.83 LT1910-M4.4
  Top-Mid 0.305: U$1.PP3 70.1,154.69 70.1,159 67.56,161.54 37.08,161.54 33.27,157.73 33.27,69.85 30.99,66.8 20.78,66.8 v20.75,66.83
SIG-M5  (via drill 0.38)
  Top 0.406: v20.75,82.58 LT1910-M5.4
  Top-Mid 0.305: U$1.PH1 71.37,158.75 67.82,162.31 36.58,162.31 32,157.73 32,85.09 30.5,82.58 v20.75,82.58
SIG-M6  (via drill 0.38)
  Top 0.406: v20.75,98.32 LT1910-M6.4
  Top-Mid 0.305: U$1.PH0 73.91,158.5 69.34,163.07 36.07,163.07 30.73,157.73 30.73,101.85 29.23,98.32 v20.75,98.32
SIG-M7  (via drill 0.38)
  Top 0.406: v20.75,114.07 LT1910-M7.4
  Top-Mid 0.305: U$1.PA7 80.26,154.69 80.26,158.75 75.18,163.83 35.56,163.83 29.46,157.73 29.46,116.08 27.46,114.07 v20.75,114.07
SIG-M8  (via drill 0.38)
  Top 0.305: v20.83,129.79 20.83,127.73 LT1910-M8.4
  Top-Mid 0.305: U$1.PP5 82.8,154.69 82.8,158.75 76.96,164.59 35.05,164.59 28.19,157.73 28.19,132.84 25.15,129.79 v20.83,129.79
SOURCE-M1
  Top 0.406: LEDRES-M1.1 24.64,11.68 TOPAPP-M1.P$2
  pour Top (no thermals): 27.94,17.78 27.94,10.92 25.65,8.64 22.86,8.64 20.83,10.67 20.83,14.73 23.88,17.78
SOURCE-M2
  Top 0.406: LEDRES-M2.1 24.64,27.43 TOPAPP-M2.P$2
  pour Top (no thermals): 27.94,33.53 27.94,26.67 25.65,24.38 22.86,24.38 20.83,26.42 20.83,30.48 23.88,33.53
SOURCE-M3
  Top 0.406: LEDRES-M3.1 24.64,43.18 TOPAPP-M3.P$2
  pour Top (no thermals): 27.94,49.28 27.94,42.42 25.65,40.13 22.86,40.13 20.83,42.16 20.83,46.23 23.88,49.28
SOURCE-M4
  Top 0.406: LEDRES-M4.1 24.64,58.93 TOPAPP-M4.P$2
  pour Top (no thermals): 27.94,65.02 27.94,58.17 25.65,55.88 22.86,55.88 20.83,57.91 20.83,61.98 23.88,65.02
SOURCE-M5
  Top 0.406: LEDRES-M5.1 24.64,74.68 TOPAPP-M5.P$2
  pour Top (no thermals): 27.94,80.77 27.94,73.91 25.65,71.63 22.86,71.63 20.83,73.66 20.83,77.72 23.88,80.77
SOURCE-M6
  Top 0.406: LEDRES-M6.1 24.64,90.42 TOPAPP-M6.P$2
  pour Top (no thermals): 27.94,96.52 27.94,89.66 25.65,87.38 22.86,87.38 20.83,89.41 20.83,93.47 23.88,96.52
SOURCE-M7
  Top 0.406: LEDRES-M7.1 24.64,106.17 TOPAPP-M7.P$2
  pour Top (no thermals): 27.94,112.27 27.94,105.41 25.65,103.12 22.86,103.12 20.83,105.16 20.83,109.22 23.88,112.27
SOURCE-M8
  Top 0.406: LEDRES-M8.1 24.64,121.92 TOPAPP-M8.P$2
  pour Top (no thermals): 27.94,128.02 27.94,121.16 25.65,118.87 22.86,118.87 20.83,120.9 20.83,124.97 23.88,128.02
TRANS+  (via drill 0.38)
  Top 0.305: R6.2 107.82,178.75 U$12.Y
  Bot-Mid 0.305: U$6.3 134.87,32.89 134.87,31.75 134.11,30.99 117.86,30.99 112.78,36.07 112.78,173.35 R6.2
  other vias: 107.82,178.31
TRANS+1  (via drill 0.38)
  Top 0.305: R7.2 U$24.Y
  Bot-Mid 0.305: U$5.3 134.87,49.15 134.87,48.51 134.11,47.75 123.95,47.75 116.84,54.86 116.84,177.42 R7.2
  other vias: 117.73,178.31
TRANS-  (via drill 0.38)
  Top 0.305: R6.1 111.12,178.81 U$12.Z
  Bot-Mid 0.305: U$6.6 133.22,38.35 119.89,38.35 113.54,44.7 113.54,175.39 R6.1
  other vias: 110.62,178.31
TRANS-1  (via drill 0.38)
  Top 0.305: R7.1 121.03,178.81 U$24.Z
  Bot-Mid 0.305: U$5.6 133.58,54.25 122.73,54.25 117.6,59.38 117.6,175.38 R7.1
  other vias: 120.53,178.31
TX1
  Top 0.406: U$24.DI 121.03,187.58 122.17,188.72 136.91,188.72 143.76,195.58 143.76,197.87 U$1.PC5
TX2
  Top 0.406: U$1.PP1 82.8,197.87 82.8,195.58 83.31,195.07 103.38,195.07 111.12,187.32 U$12.DI
V_BATT
  Top 0.305: R3.2 85.6,130.05 84.84,128.02
  Top 0.406: 83.97,128.63 84.84,128.02
  pour Top (rank 2, no thermals): 50.55,133.6 50.55,8.89 55.72,1.75 83.31,1.75 83.31,18.29 86.11,18.29 86.11,130.3 56.39,130.3 56.39,133.1 55.88,133.6
  pour Top (no thermals): 83.82,93.98 95.25,93.98 97.03,92.2 97.03,90.42 95.5,88.9 83.57,88.9 82.55,89.92 82.55,92.71
  pour Top (no thermals): 83.82,118.36 95.25,118.36 97.03,116.59 97.03,114.81 95.5,113.28 83.57,113.28 82.55,114.3 82.55,117.09
  pour Top: 82.55,19.05 82.55,1.78 86.11,1.78 86.11,19.05
  pour Top (no thermals): 45.97,21.08 45.97,16.76 50.55,16.76 50.55,21.08
  pour Top (no thermals): 45.97,36.83 45.97,32.51 50.55,32.51 50.55,36.83
  pour Top (no thermals): 45.97,52.58 45.97,48.26 50.55,48.26 50.55,52.58
  pour Top (no thermals): 45.97,68.33 45.97,64.01 50.55,64.01 50.55,68.33
  pour Top (no thermals): 45.97,84.07 45.97,79.76 50.55,79.76 50.55,84.07
  pour Top (no thermals): 45.97,99.82 45.97,95.5 50.55,95.5 50.55,99.82
  pour Top (no thermals): 45.97,115.57 45.97,111.25 50.55,111.25 50.55,115.57
  pour Top (no thermals): 45.97,131.32 45.97,127 50.55,127 50.55,131.32
VMEAS-VBATT  (via drill 0.38)
  Top 0.305: R3.1 R4.2 86.87,135.28 v86.87,136.91
  Bot-Mid 0.305: v86.87,136.91 86.87,148.34 86.11,149.1 41.91,149.1 39.88,151.13 39.88,180.85 42.67,183.64 80.52,183.64 88.9,192.02 135.38,192.02 U$1.PE3

### Text on the board
Top: ROVE DOWN FOR WHAT
Bot-Mid: obama did 9/11
tPlace: GND | +5V | +12V | A2 | REY-5V | A1 | M6 | M5 | RS-485 | M4 | M3 | M2 | + - | Missouri S&T Mars Rover / Cameron Nichols / Power Board 2016 | M1 | + - / VPACK